# Altium project SoBQ.PrjPCB
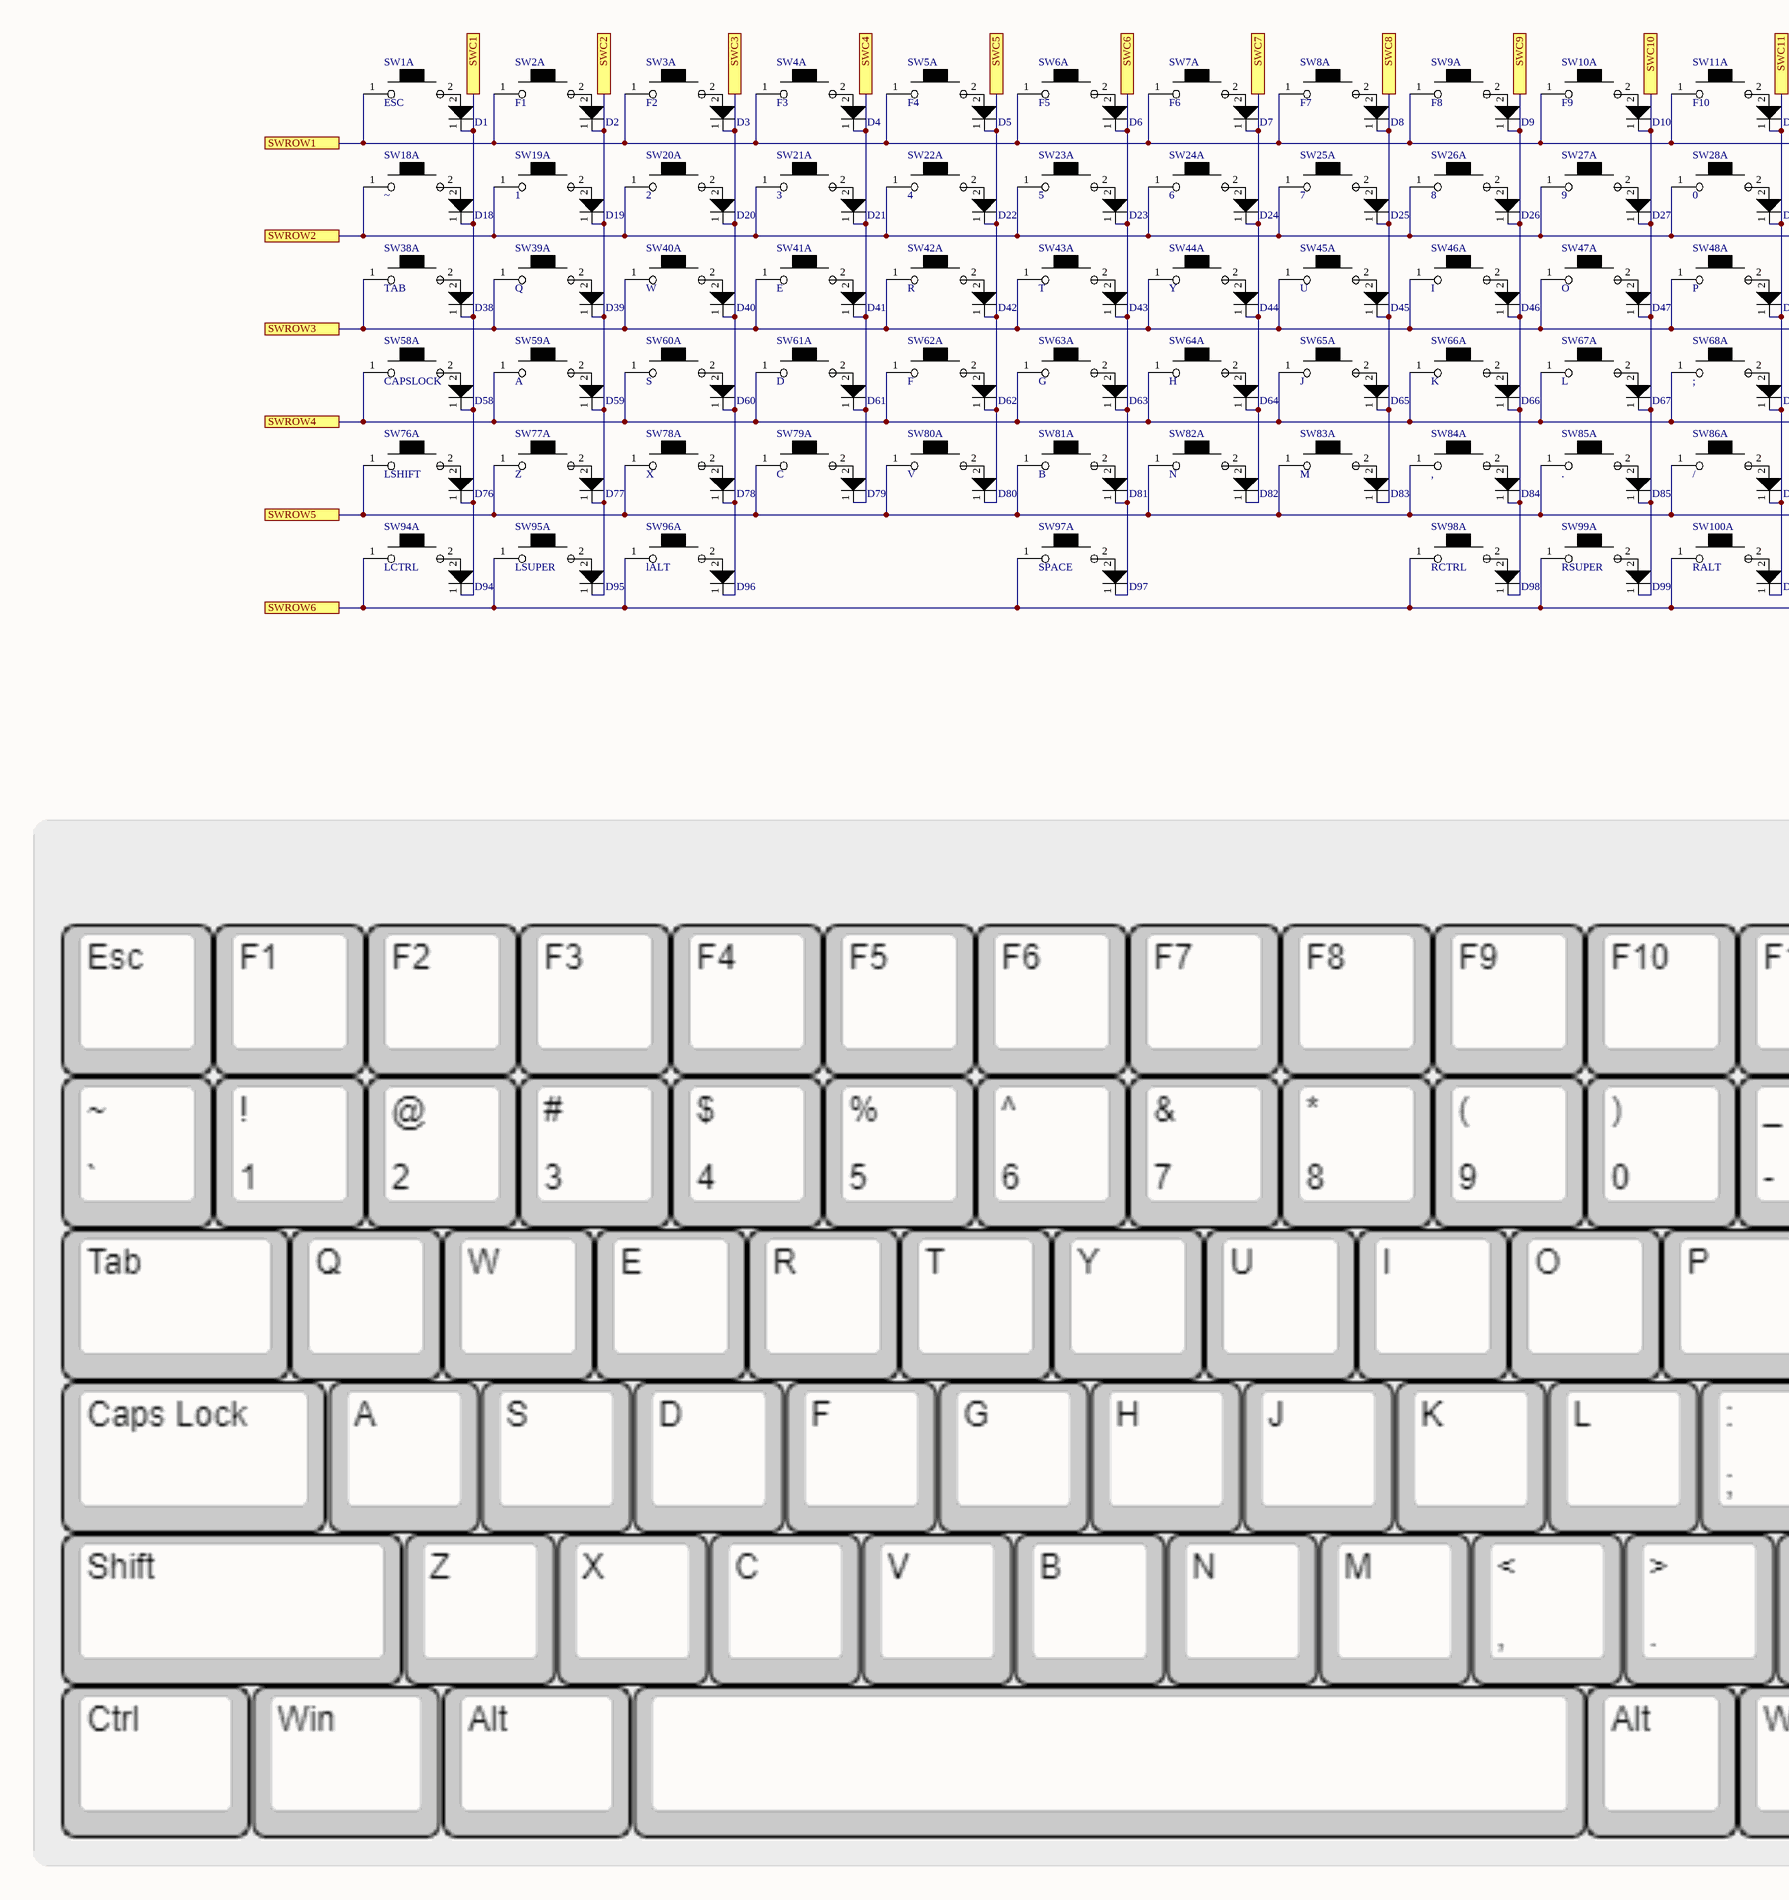
[diagram p0: switches.SchDoc, left]
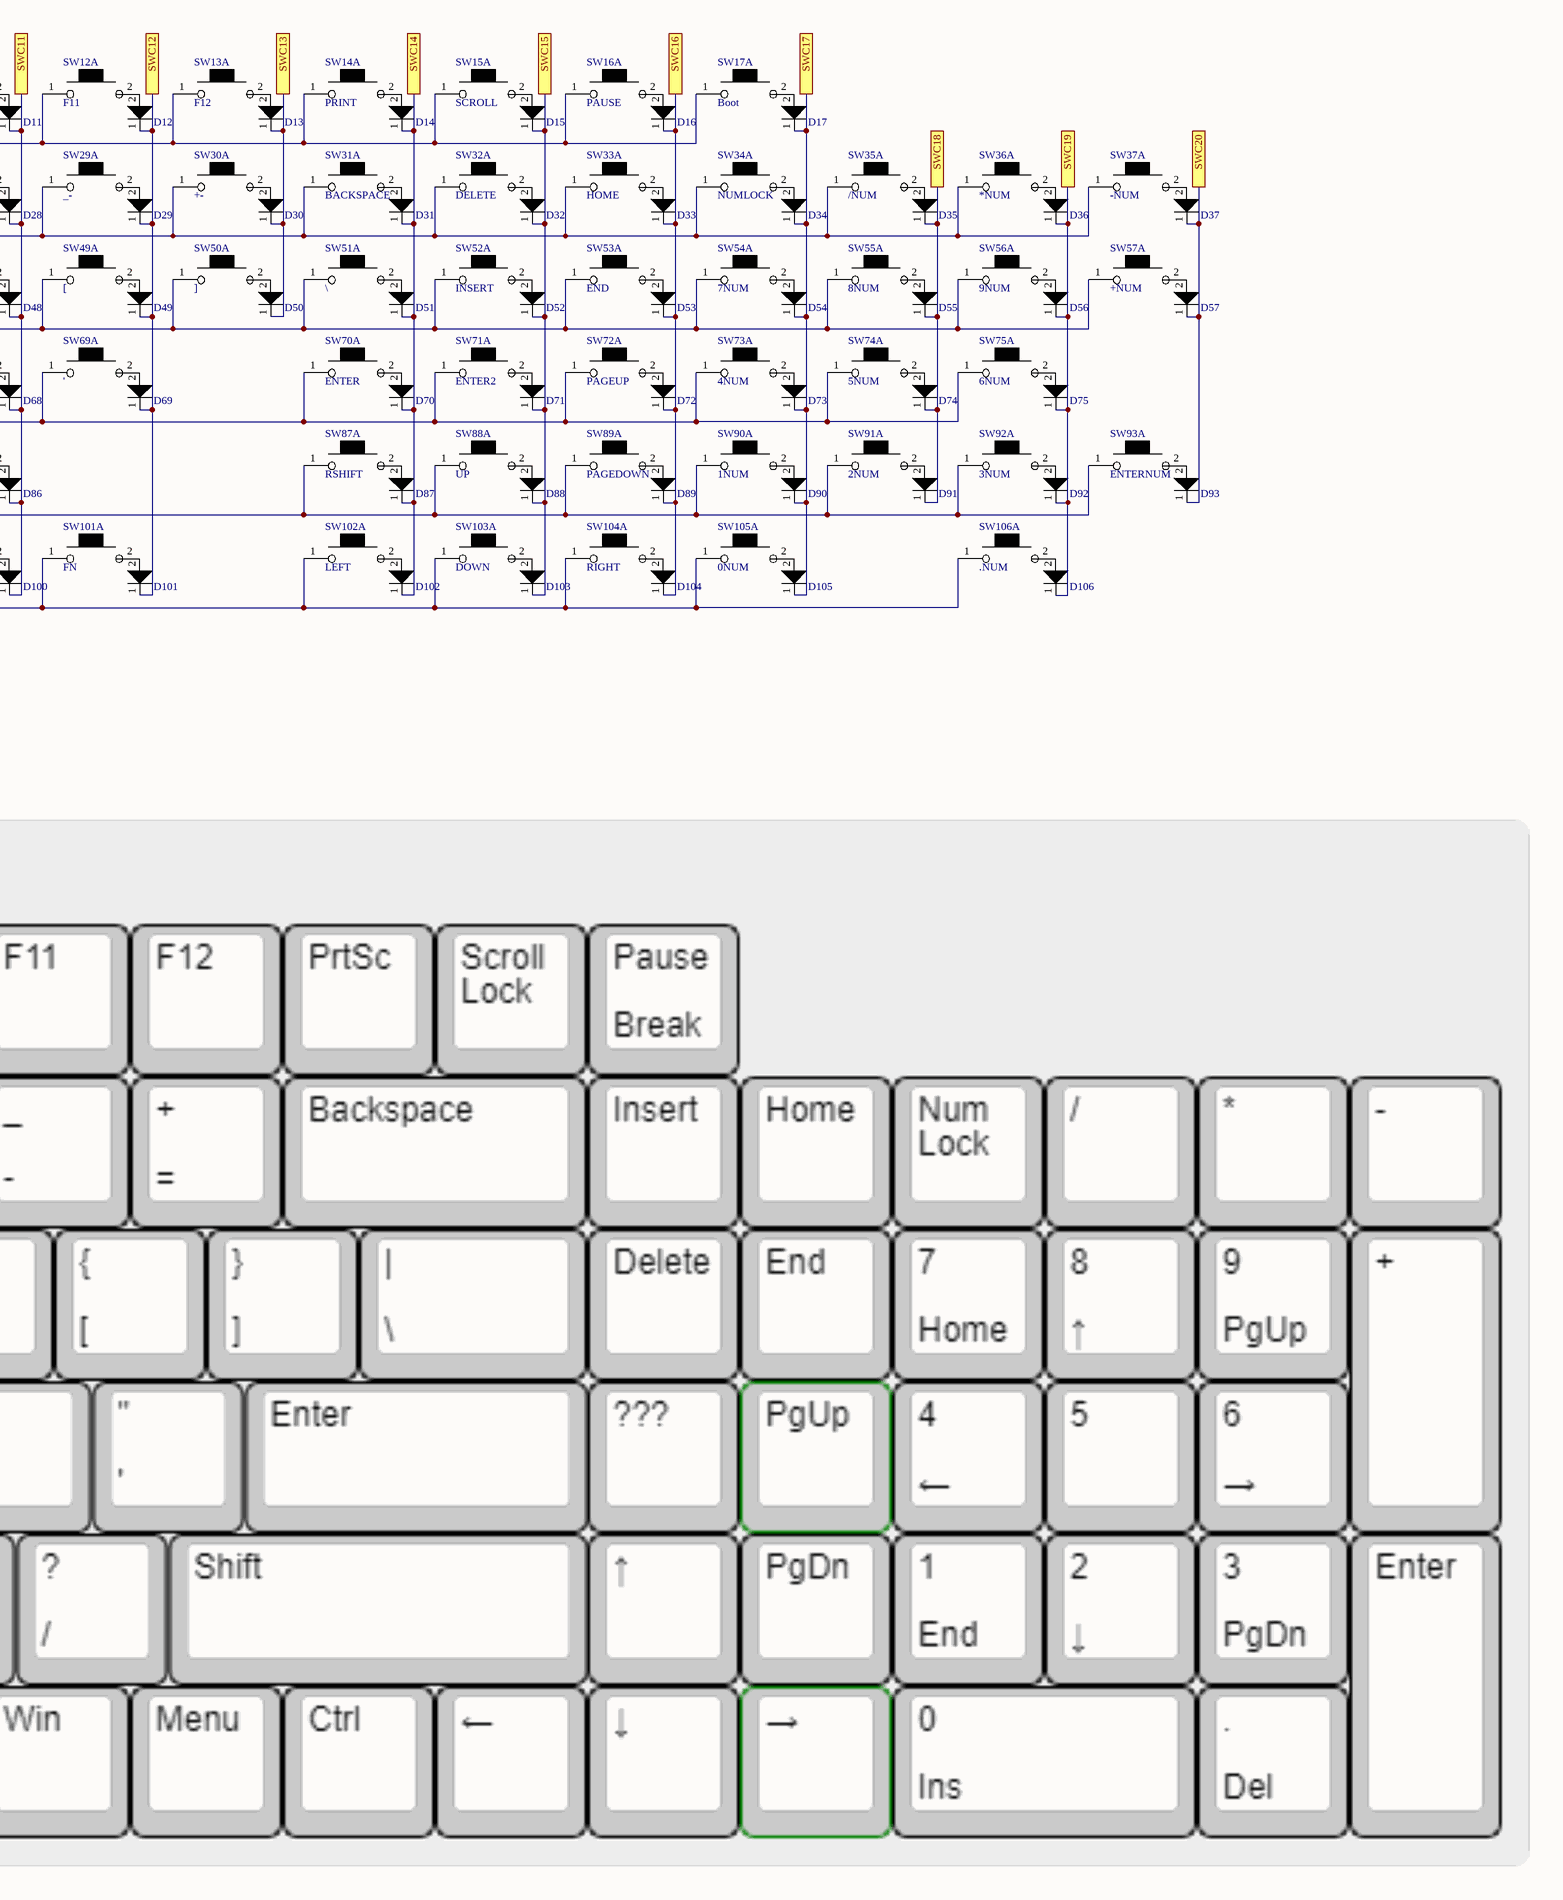
[diagram p1: switches.SchDoc, right]
3 sheets, 315 parts. Net scope: flat (ports and power ports of the same name join across sheets).
Board file: SoBQ.PcbDoc
Sheets:
  switches.SchDoc
  LED.SchDoc
  MCU.SchDoc

## Sheet switches.SchDoc
size D

### Parts
D1  1N4148WTR  [SOD-123]  (value not drawn)
D2  1N4148WTR  [SOD-123]  (value not drawn)
D3  1N4148WTR  [SOD-123]  (value not drawn)
D4  1N4148WTR  [SOD-123]  (value not drawn)
D5  1N4148WTR  [SOD-123]  (value not drawn)
D6  1N4148WTR  [SOD-123]  (value not drawn)
D7  1N4148WTR  [SOD-123]  (value not drawn)
D8  1N4148WTR  [SOD-123]  (value not drawn)
D9  1N4148WTR  [SOD-123]  (value not drawn)
D10  1N4148WTR  [SOD-123]  (value not drawn)
D11  1N4148WTR  [SOD-123]  (value not drawn)
D12  1N4148WTR  [SOD-123]  (value not drawn)
D13  1N4148WTR  [SOD-123]  (value not drawn)
D14  1N4148WTR  [SOD-123]  (value not drawn)
D15  1N4148WTR  [SOD-123]  (value not drawn)
D16  1N4148WTR  [SOD-123]  (value not drawn)
D17  1N4148WTR  [SOD-123]  (value not drawn)
D18  1N4148WTR  [SOD-123]  (value not drawn)
D19  1N4148WTR  [SOD-123]  (value not drawn)
D20  1N4148WTR  [SOD-123]  (value not drawn)
D21  1N4148WTR  [SOD-123]  (value not drawn)
D22  1N4148WTR  [SOD-123]  (value not drawn)
D23  1N4148WTR  [SOD-123]  (value not drawn)
D24  1N4148WTR  [SOD-123]  (value not drawn)
D25  1N4148WTR  [SOD-123]  (value not drawn)
D26  1N4148WTR  [SOD-123]  (value not drawn)
D27  1N4148WTR  [SOD-123]  (value not drawn)
D28  1N4148WTR  [SOD-123]  (value not drawn)
D29  1N4148WTR  [SOD-123]  (value not drawn)
D30  1N4148WTR  [SOD-123]  (value not drawn)
D31  1N4148WTR  [SOD-123]  (value not drawn)
D32  1N4148WTR  [SOD-123]  (value not drawn)
D33  1N4148WTR  [SOD-123]  (value not drawn)
D34  1N4148WTR  [SOD-123]  (value not drawn)
D35  1N4148WTR  [SOD-123]  (value not drawn)
D36  1N4148WTR  [SOD-123]  (value not drawn)
D37  1N4148WTR  [SOD-123]  (value not drawn)
D38  1N4148WTR  [SOD-123]  (value not drawn)
D39  1N4148WTR  [SOD-123]  (value not drawn)
D40  1N4148WTR  [SOD-123]  (value not drawn)
D41  1N4148WTR  [SOD-123]  (value not drawn)
D42  1N4148WTR  [SOD-123]  (value not drawn)
D43  1N4148WTR  [SOD-123]  (value not drawn)
D44  1N4148WTR  [SOD-123]  (value not drawn)
D45  1N4148WTR  [SOD-123]  (value not drawn)
D46  1N4148WTR  [SOD-123]  (value not drawn)
D47  1N4148WTR  [SOD-123]  (value not drawn)
D48  1N4148WTR  [SOD-123]  (value not drawn)
D49  1N4148WTR  [SOD-123]  (value not drawn)
D50  1N4148WTR  [SOD-123]  (value not drawn)
D51  1N4148WTR  [SOD-123]  (value not drawn)
D52  1N4148WTR  [SOD-123]  (value not drawn)
D53  1N4148WTR  [SOD-123]  (value not drawn)
D54  1N4148WTR  [SOD-123]  (value not drawn)
D55  1N4148WTR  [SOD-123]  (value not drawn)
D56  1N4148WTR  [SOD-123]  (value not drawn)
D57  1N4148WTR  [SOD-123]  (value not drawn)
D58  1N4148WTR  [SOD-123]  (value not drawn)
D59  1N4148WTR  [SOD-123]  (value not drawn)
D60  1N4148WTR  [SOD-123]  (value not drawn)
D61  1N4148WTR  [SOD-123]  (value not drawn)
D62  1N4148WTR  [SOD-123]  (value not drawn)
D63  1N4148WTR  [SOD-123]  (value not drawn)
D64  1N4148WTR  [SOD-123]  (value not drawn)
D65  1N4148WTR  [SOD-123]  (value not drawn)
D66  1N4148WTR  [SOD-123]  (value not drawn)
D67  1N4148WTR  [SOD-123]  (value not drawn)
D68  1N4148WTR  [SOD-123]  (value not drawn)
D69  1N4148WTR  [SOD-123]  (value not drawn)
D70  1N4148WTR  [SOD-123]  (value not drawn)
D71  1N4148WTR  [SOD-123]  (value not drawn)
D72  1N4148WTR  [SOD-123]  (value not drawn)
D73  1N4148WTR  [SOD-123]  (value not drawn)
D74  1N4148WTR  [SOD-123]  (value not drawn)
D75  1N4148WTR  [SOD-123]  (value not drawn)
D76  1N4148WTR  [SOD-123]  (value not drawn)
D77  1N4148WTR  [SOD-123]  (value not drawn)
D78  1N4148WTR  [SOD-123]  (value not drawn)
D79  1N4148WTR  [SOD-123]  (value not drawn)
D80  1N4148WTR  [SOD-123]  (value not drawn)
D81  1N4148WTR  [SOD-123]  (value not drawn)
D82  1N4148WTR  [SOD-123]  (value not drawn)
D83  1N4148WTR  [SOD-123]  (value not drawn)
D84  1N4148WTR  [SOD-123]  (value not drawn)
D85  1N4148WTR  [SOD-123]  (value not drawn)
D86  1N4148WTR  [SOD-123]  (value not drawn)
D87  1N4148WTR  [SOD-123]  (value not drawn)
D88  1N4148WTR  [SOD-123]  (value not drawn)
D89  1N4148WTR  [SOD-123]  (value not drawn)
D90  1N4148WTR  [SOD-123]  (value not drawn)
D91  1N4148WTR  [SOD-123]  (value not drawn)
D92  1N4148WTR  [SOD-123]  (value not drawn)
D93  1N4148WTR  [SOD-123]  (value not drawn)
D94  1N4148WTR  [SOD-123]  (value not drawn)
D95  1N4148WTR  [SOD-123]  (value not drawn)
D96  1N4148WTR  [SOD-123]  (value not drawn)
D97  1N4148WTR  [SOD-123]  (value not drawn)
D98  1N4148WTR  [SOD-123]  (value not drawn)
D99  1N4148WTR  [SOD-123]  (value not drawn)
D100  1N4148WTR  [SOD-123]  (value not drawn)
D101  1N4148WTR  [SOD-123]  (value not drawn)
D102  1N4148WTR  [SOD-123]  (value not drawn)
D103  1N4148WTR  [SOD-123]  (value not drawn)
D104  1N4148WTR  [SOD-123]  (value not drawn)
D105  1N4148WTR  [SOD-123]  (value not drawn)
D106  1N4148WTR  [SOD-123]  (value not drawn)
SW1  ESC  [SWITCH_U1_W_LED]  (part A of 2)
SW2  F1  [SWITCH_U1_W_LED]  (part A of 2)
SW3  F2  [SWITCH_U1_W_LED]  (part A of 2)
SW4  F3  [SWITCH_U1_W_LED]  (part A of 2)
SW5  F4  [SWITCH_U1_W_LED]  (part A of 2)
SW6  F5  [SWITCH_U1_W_LED]  (part A of 2)
SW7  F6  [SWITCH_U1_W_LED]  (part A of 2)
SW8  F7  [SWITCH_U1_W_LED]  (part A of 2)
SW9  F8  [SWITCH_U1_W_LED]  (part A of 2)
SW10  F9  [SWITCH_U1_W_LED]  (part A of 2)
SW11  F10  [SWITCH_U1_W_LED]  (part A of 2)
SW12  F11  [SWITCH_U1_W_LED]  (part A of 2)
SW13  F12  [SWITCH_U1_W_LED]  (part A of 2)
SW14  PRINT  [SWITCH_U1_W_LED]  (part A of 2)
SW15  SCROLL  [SWITCH_U1_W_LED]  (part A of 2)
SW16  PAUSE  [SWITCH_U1_W_LED]  (part A of 2)
SW17  Boot  [SWITCH_U1_W_LED]  (part A of 2)
SW18  ~  [SWITCH_U1_W_LED]  (part A of 2)
SW19  1  [SWITCH_U1_W_LED]  (part A of 2)
SW20  2  [SWITCH_U1_W_LED]  (part A of 2)
SW21  3  [SWITCH_U1_W_LED]  (part A of 2)
SW22  4  [SWITCH_U1_W_LED]  (part A of 2)
SW23  5  [SWITCH_U1_W_LED]  (part A of 2)
SW24  6  [SWITCH_U1_W_LED]  (part A of 2)
SW25  7  [SWITCH_U1_W_LED]  (part A of 2)
SW26  8  [SWITCH_U1_W_LED]  (part A of 2)
SW27  9  [SWITCH_U1_W_LED]  (part A of 2)
SW28  0  [SWITCH_U1_W_LED]  (part A of 2)
SW29  _-  [SWITCH_U1_W_LED]  (part A of 2)
SW30  +-  [SWITCH_U1_W_LED]  (part A of 2)
SW31  BACKSPACE  [SWITCH_U2_W_LED]  (part A of 2)
SW32  DELETE  [SWITCH_U1_W_LED]  (part A of 2)
SW33  HOME  [SWITCH_U1_W_LED]  (part A of 2)
SW34  NUMLOCK  [SWITCH_U1_W_LED]  (part A of 2)
SW35  /NUM  [SWITCH_U1_W_LED]  (part A of 2)
SW36  *NUM  [SWITCH_U1_W_LED]  (part A of 2)
SW37  -NUM  [SWITCH_U1_W_LED]  (part A of 2)
SW38  TAB  [SWITCH_U1.50_W_LED]  (part A of 2)
SW39  Q  [SWITCH_U1_W_LED]  (part A of 2)
SW40  W  [SWITCH_U1_W_LED]  (part A of 2)
SW41  E  [SWITCH_U1_W_LED]  (part A of 2)
SW42  R  [SWITCH_U1_W_LED]  (part A of 2)
SW43  T  [SWITCH_U1_W_LED]  (part A of 2)
SW44  Y  [SWITCH_U1_W_LED]  (part A of 2)
SW45  U  [SWITCH_U1_W_LED]  (part A of 2)
SW46  I  [SWITCH_U1_W_LED]  (part A of 2)
SW47  O  [SWITCH_U1_W_LED]  (part A of 2)
SW48  P  [SWITCH_U1_W_LED]  (part A of 2)
SW49  [  [SWITCH_U1_W_LED]  (part A of 2)
SW50  ]  [SWITCH_U1_W_LED]  (part A of 2)
SW51  \  [SWITCH_U1.50_W_LED]  (part A of 2)
SW52  INSERT  [SWITCH_U1_W_LED]  (part A of 2)
SW53  END  [SWITCH_U1_W_LED]  (part A of 2)
SW54  7NUM  [SWITCH_U1_W_LED]  (part A of 2)
SW55  8NUM  [SWITCH_U1_W_LED]  (part A of 2)
SW56  9NUM  [SWITCH_U1_W_LED]  (part A of 2)
SW57  +NUM  [SWITCH_U2_W_LED - vert]  (part A of 2)
SW58  CAPSLOCK  [SWITCH_U1.75_W_LED]  (part A of 2)
SW59  A  [SWITCH_U1_W_LED]  (part A of 2)
SW60  S  [SWITCH_U1_W_LED]  (part A of 2)
SW61  D  [SWITCH_U1_W_LED]  (part A of 2)
SW62  F  [SWITCH_U1_W_LED]  (part A of 2)
SW63  G  [SWITCH_U1_W_LED]  (part A of 2)
SW64  H  [SWITCH_U1_W_LED]  (part A of 2)
SW65  J  [SWITCH_U1_W_LED]  (part A of 2)
SW66  K  [SWITCH_U1_W_LED]  (part A of 2)
SW67  L  [SWITCH_U1_W_LED]  (part A of 2)
SW68  ;  [SWITCH_U1_W_LED]  (part A of 2)
SW69  '  [SWITCH_U1_W_LED]  (part A of 2)
SW70  ENTER  [SWITCH_U2.25_W_LED]  (part A of 2)
SW71  ENTER2  [SWITCH_U1_W_LED]  (part A of 2)
SW72  PAGEUP  [SWITCH_U1_W_LED]  (part A of 2)
SW73  4NUM  [SWITCH_U1_W_LED]  (part A of 2)
SW74  5NUM  [SWITCH_U1_W_LED]  (part A of 2)
SW75  6NUM  [SWITCH_U1_W_LED]  (part A of 2)
SW76  LSHIFT  [SWITCH_U2.25_W_LED]  (part A of 2)
SW77  Z  [SWITCH_U1_W_LED]  (part A of 2)
SW78  X  [SWITCH_U1_W_LED]  (part A of 2)
SW79  C  [SWITCH_U1_W_LED]  (part A of 2)
SW80  V  [SWITCH_U1_W_LED]  (part A of 2)
SW81  B  [SWITCH_U1_W_LED]  (part A of 2)
SW82  N  [SWITCH_U1_W_LED]  (part A of 2)
SW83  M  [SWITCH_U1_W_LED]  (part A of 2)
SW84  ,  [SWITCH_U1_W_LED]  (part A of 2)
SW85  .  [SWITCH_U1_W_LED]  (part A of 2)
SW86  /  [SWITCH_U1_W_LED]  (part A of 2)
SW87  RSHIFT  [SWITCH_U2.75_W_LED]  (part A of 2)
SW88  UP  [SWITCH_U1_W_LED]  (part A of 2)
SW89  PAGEDOWN  [SWITCH_U1_W_LED]  (part A of 2)
SW90  1NUM  [SWITCH_U1_W_LED]  (part A of 2)
SW91  2NUM  [SWITCH_U1_W_LED]  (part A of 2)
SW92  3NUM  [SWITCH_U1_W_LED]  (part A of 2)
SW93  ENTERNUM  [SWITCH_U2_W_LED - vert]  (part A of 2)
SW94  LCTRL  [SWITCH_U1.25_W_LED]  (part A of 2)
SW95  LSUPER  [SWITCH_U1.25_W_LED]  (part A of 2)
SW96  lALT  [SWITCH_U1.25_W_LED]  (part A of 2)
SW97  SPACE  [SWITCH_U6.25_W_LED - duplicate]  (part A of 2)
SW98  RCTRL  [SWITCH_U1_W_LED]  (part A of 2)
SW99  RSUPER  [SWITCH_U1_W_LED]  (part A of 2)
SW100  RALT  [SWITCH_U1_W_LED]  (part A of 2)
SW101  FN  [SWITCH_U1_W_LED]  (part A of 2)
SW102  LEFT  [SWITCH_U1_W_LED]  (part A of 2)
SW103  DOWN  [SWITCH_U1_W_LED]  (part A of 2)
SW104  RIGHT  [SWITCH_U1_W_LED]  (part A of 2)
SW105  0NUM  [SWITCH_U2_W_LED]  (part A of 2)
SW106  .NUM  [SWITCH_U1_W_LED]  (part A of 2)

### Ports
SWC1, SWC2, SWC3, SWC4, SWC5, SWC6, SWC7, SWC8, SWC9, SWC10, SWC11, SWC12, SWC13, SWC14, SWC15, SWC16, SWC17, SWC18, SWC19, SWC20, SWROW1, SWROW2, SWROW3, SWROW4, SWROW5, SWROW6

### Nets
NetD1_1: D1.1 D18.1 D38.1 D58.1 D76.1 D94.1 ; port SWC1
NetD1_2: D1.2 SW1.2
NetD2_1: D2.1 D19.1 D39.1 D59.1 D77.1 D95.1 ; port SWC2
NetD2_2: D2.2 SW2.2
NetD3_1: D3.1 D20.1 D40.1 D60.1 D78.1 D96.1 ; port SWC3
NetD3_2: D3.2 SW3.2
NetD4_1: D4.1 D21.1 D41.1 D61.1 D79.1 ; port SWC4
NetD4_2: D4.2 SW4.2
NetD5_1: D5.1 D22.1 D42.1 D62.1 D80.1 ; port SWC5
NetD5_2: D5.2 SW5.2
NetD6_1: D6.1 D23.1 D43.1 D63.1 D81.1 D97.1 ; port SWC6
NetD6_2: D6.2 SW6.2
NetD7_1: D7.1 D24.1 D44.1 D64.1 D82.1 ; port SWC7
NetD7_2: D7.2 SW7.2
NetD8_1: D8.1 D25.1 D45.1 D65.1 D83.1 ; port SWC8
NetD8_2: D8.2 SW8.2
NetD9_1: D9.1 D26.1 D46.1 D66.1 D84.1 D98.1 ; port SWC9
NetD9_2: D9.2 SW9.2
NetD10_1: D10.1 D27.1 D47.1 D67.1 D85.1 D99.1 ; port SWC10
NetD10_2: D10.2 SW10.2
NetD11_1: D11.1 D28.1 D48.1 D68.1 D86.1 D100.1 ; port SWC11
NetD11_2: D11.2 SW11.2
NetD12_1: D12.1 D29.1 D49.1 D69.1 D101.1 ; port SWC12
NetD12_2: D12.2 SW12.2
NetD13_1: D13.1 D30.1 D50.1 ; port SWC13
NetD13_2: D13.2 SW13.2
NetD14_1: D14.1 D31.1 D51.1 D70.1 D87.1 D102.1 ; port SWC14
NetD14_2: D14.2 SW14.2
NetD15_1: D15.1 D32.1 D52.1 D71.1 D88.1 D103.1 ; port SWC15
NetD15_2: D15.2 SW15.2
NetD16_1: D16.1 D33.1 D53.1 D72.1 D89.1 D104.1 ; port SWC16
NetD16_2: D16.2 SW16.2
NetD17_1: D17.1 D34.1 D54.1 D73.1 D90.1 D105.1 ; port SWC17
NetD17_2: D17.2 SW17.2
NetD18_2: D18.2 SW18.2
NetD19_2: D19.2 SW19.2
NetD20_2: D20.2 SW20.2
NetD21_2: D21.2 SW21.2
NetD22_2: D22.2 SW22.2
NetD23_2: D23.2 SW23.2
NetD24_2: D24.2 SW24.2
NetD25_2: D25.2 SW25.2
NetD26_2: D26.2 SW26.2
NetD27_2: D27.2 SW27.2
NetD28_2: D28.2 SW28.2
NetD29_2: D29.2 SW29.2
NetD30_2: D30.2 SW30.2
NetD31_2: D31.2 SW31.2
NetD32_2: D32.2 SW32.2
NetD33_2: D33.2 SW33.2
NetD34_2: D34.2 SW34.2
NetD35_1: D35.1 D55.1 D74.1 D91.1 ; port SWC18
NetD35_2: D35.2 SW35.2
NetD36_1: D36.1 D56.1 D75.1 D92.1 D106.1 ; port SWC19
NetD36_2: D36.2 SW36.2
NetD37_1: D37.1 D57.1 D93.1 ; port SWC20
NetD37_2: D37.2 SW37.2
NetD38_2: D38.2 SW38.2
NetD39_2: D39.2 SW39.2
NetD40_2: D40.2 SW40.2
NetD41_2: D41.2 SW41.2
NetD42_2: D42.2 SW42.2
NetD43_2: D43.2 SW43.2
NetD44_2: D44.2 SW44.2
NetD45_2: D45.2 SW45.2
NetD46_2: D46.2 SW46.2
NetD47_2: D47.2 SW47.2
NetD48_2: D48.2 SW48.2
NetD49_2: D49.2 SW49.2
NetD50_2: D50.2 SW50.2
NetD51_2: D51.2 SW51.2
NetD52_2: D52.2 SW52.2
NetD53_2: D53.2 SW53.2
NetD54_2: D54.2 SW54.2
NetD55_2: D55.2 SW55.2
NetD56_2: D56.2 SW56.2
NetD57_2: D57.2 SW57.2
NetD58_2: D58.2 SW58.2
NetD59_2: D59.2 SW59.2
NetD60_2: D60.2 SW60.2
NetD61_2: D61.2 SW61.2
NetD62_2: D62.2 SW62.2
NetD63_2: D63.2 SW63.2
NetD64_2: D64.2 SW64.2
NetD65_2: D65.2 SW65.2
NetD66_2: D66.2 SW66.2
NetD67_2: D67.2 SW67.2
NetD68_2: D68.2 SW68.2
NetD69_2: D69.2 SW69.2
NetD70_2: D70.2 SW70.2
NetD71_2: D71.2 SW71.2
NetD72_2: D72.2 SW72.2
NetD73_2: D73.2 SW73.2
NetD74_2: D74.2 SW74.2
NetD75_2: D75.2 SW75.2
NetD76_2: D76.2 SW76.2
NetD77_2: D77.2 SW77.2
NetD78_2: D78.2 SW78.2
NetD79_2: D79.2 SW79.2
NetD80_2: D80.2 SW80.2
NetD81_2: D81.2 SW81.2
NetD82_2: D82.2 SW82.2
NetD83_2: D83.2 SW83.2
NetD84_2: D84.2 SW84.2
NetD85_2: D85.2 SW85.2
NetD86_2: D86.2 SW86.2
NetD87_2: D87.2 SW87.2
NetD88_2: D88.2 SW88.2
NetD89_2: D89.2 SW89.2
NetD90_2: D90.2 SW90.2
NetD91_2: D91.2 SW91.2
NetD92_2: D92.2 SW92.2
NetD93_2: D93.2 SW93.2
NetD94_2: D94.2 SW94.2
NetD95_2: D95.2 SW95.2
NetD96_2: D96.2 SW96.2
NetD97_2: D97.2 SW97.2
NetD98_2: D98.2 SW98.2
NetD99_2: D99.2 SW99.2
NetD100_2: D100.2 SW100.2
NetD101_2: D101.2 SW101.2
NetD102_2: D102.2 SW102.2
NetD103_2: D103.2 SW103.2
NetD104_2: D104.2 SW104.2
NetD105_2: D105.2 SW105.2
NetD106_2: D106.2 SW106.2
NetR39_2: SW94.1 SW95.1 SW96.1 SW97.1 SW98.1 SW99.1 SW100.1 SW101.1 SW102.1 SW103.1 SW104.1 SW105.1 SW106.1 ; port SWROW6
NetR45_2: SW76.1 SW77.1 SW78.1 SW79.1 SW80.1 SW81.1 SW82.1 SW83.1 SW84.1 SW85.1 SW86.1 SW87.1 SW88.1 SW89.1 SW90.1 SW91.1 SW92.1 SW93.1 ; port SWROW5
NetR47_2: SW58.1 SW59.1 SW60.1 SW61.1 SW62.1 SW63.1 SW64.1 SW65.1 SW66.1 SW67.1 SW68.1 SW69.1 SW70.1 SW71.1 SW72.1 SW73.1 SW74.1 SW75.1 ; port SWROW4
NetR48_2: SW38.1 SW39.1 SW40.1 SW41.1 SW42.1 SW43.1 SW44.1 SW45.1 SW46.1 SW47.1 SW48.1 SW49.1 SW50.1 SW51.1 SW52.1 SW53.1 SW54.1 SW55.1 SW56.1 SW57.1 ; port SWROW3
NetR49_2: SW18.1 SW19.1 SW20.1 SW21.1 SW22.1 SW23.1 SW24.1 SW25.1 SW26.1 SW27.1 SW28.1 SW29.1 SW30.1 SW31.1 SW32.1 SW33.1 SW34.1 SW35.1 SW36.1 SW37.1 ; port SWROW2
NetR50_2: SW1.1 SW2.1 SW3.1 SW4.1 SW5.1 SW6.1 SW7.1 SW8.1 SW9.1 SW10.1 SW11.1 SW12.1 SW13.1 SW14.1 SW15.1 SW16.1 SW17.1 ; port SWROW1

### Notes on the sheet
- Title
- Size:
- Date:
- File:
- D
- Number:
- Time:
- Revision:
- Sheet
- of

### Library data of the parts
SW1-SW106 = MX_SWITCH_SINGLE_W_SMD_LED: Supplier 1: Mouser; Supplier Part Number 1: 630-ASMB-MTB0-0A3A2
D1-D106 = 1N4148WTR: Supplier 1: Digi-Key; Supplier Part Number 1: 1655-1360-1-ND

## Sheet LED.SchDoc
size C
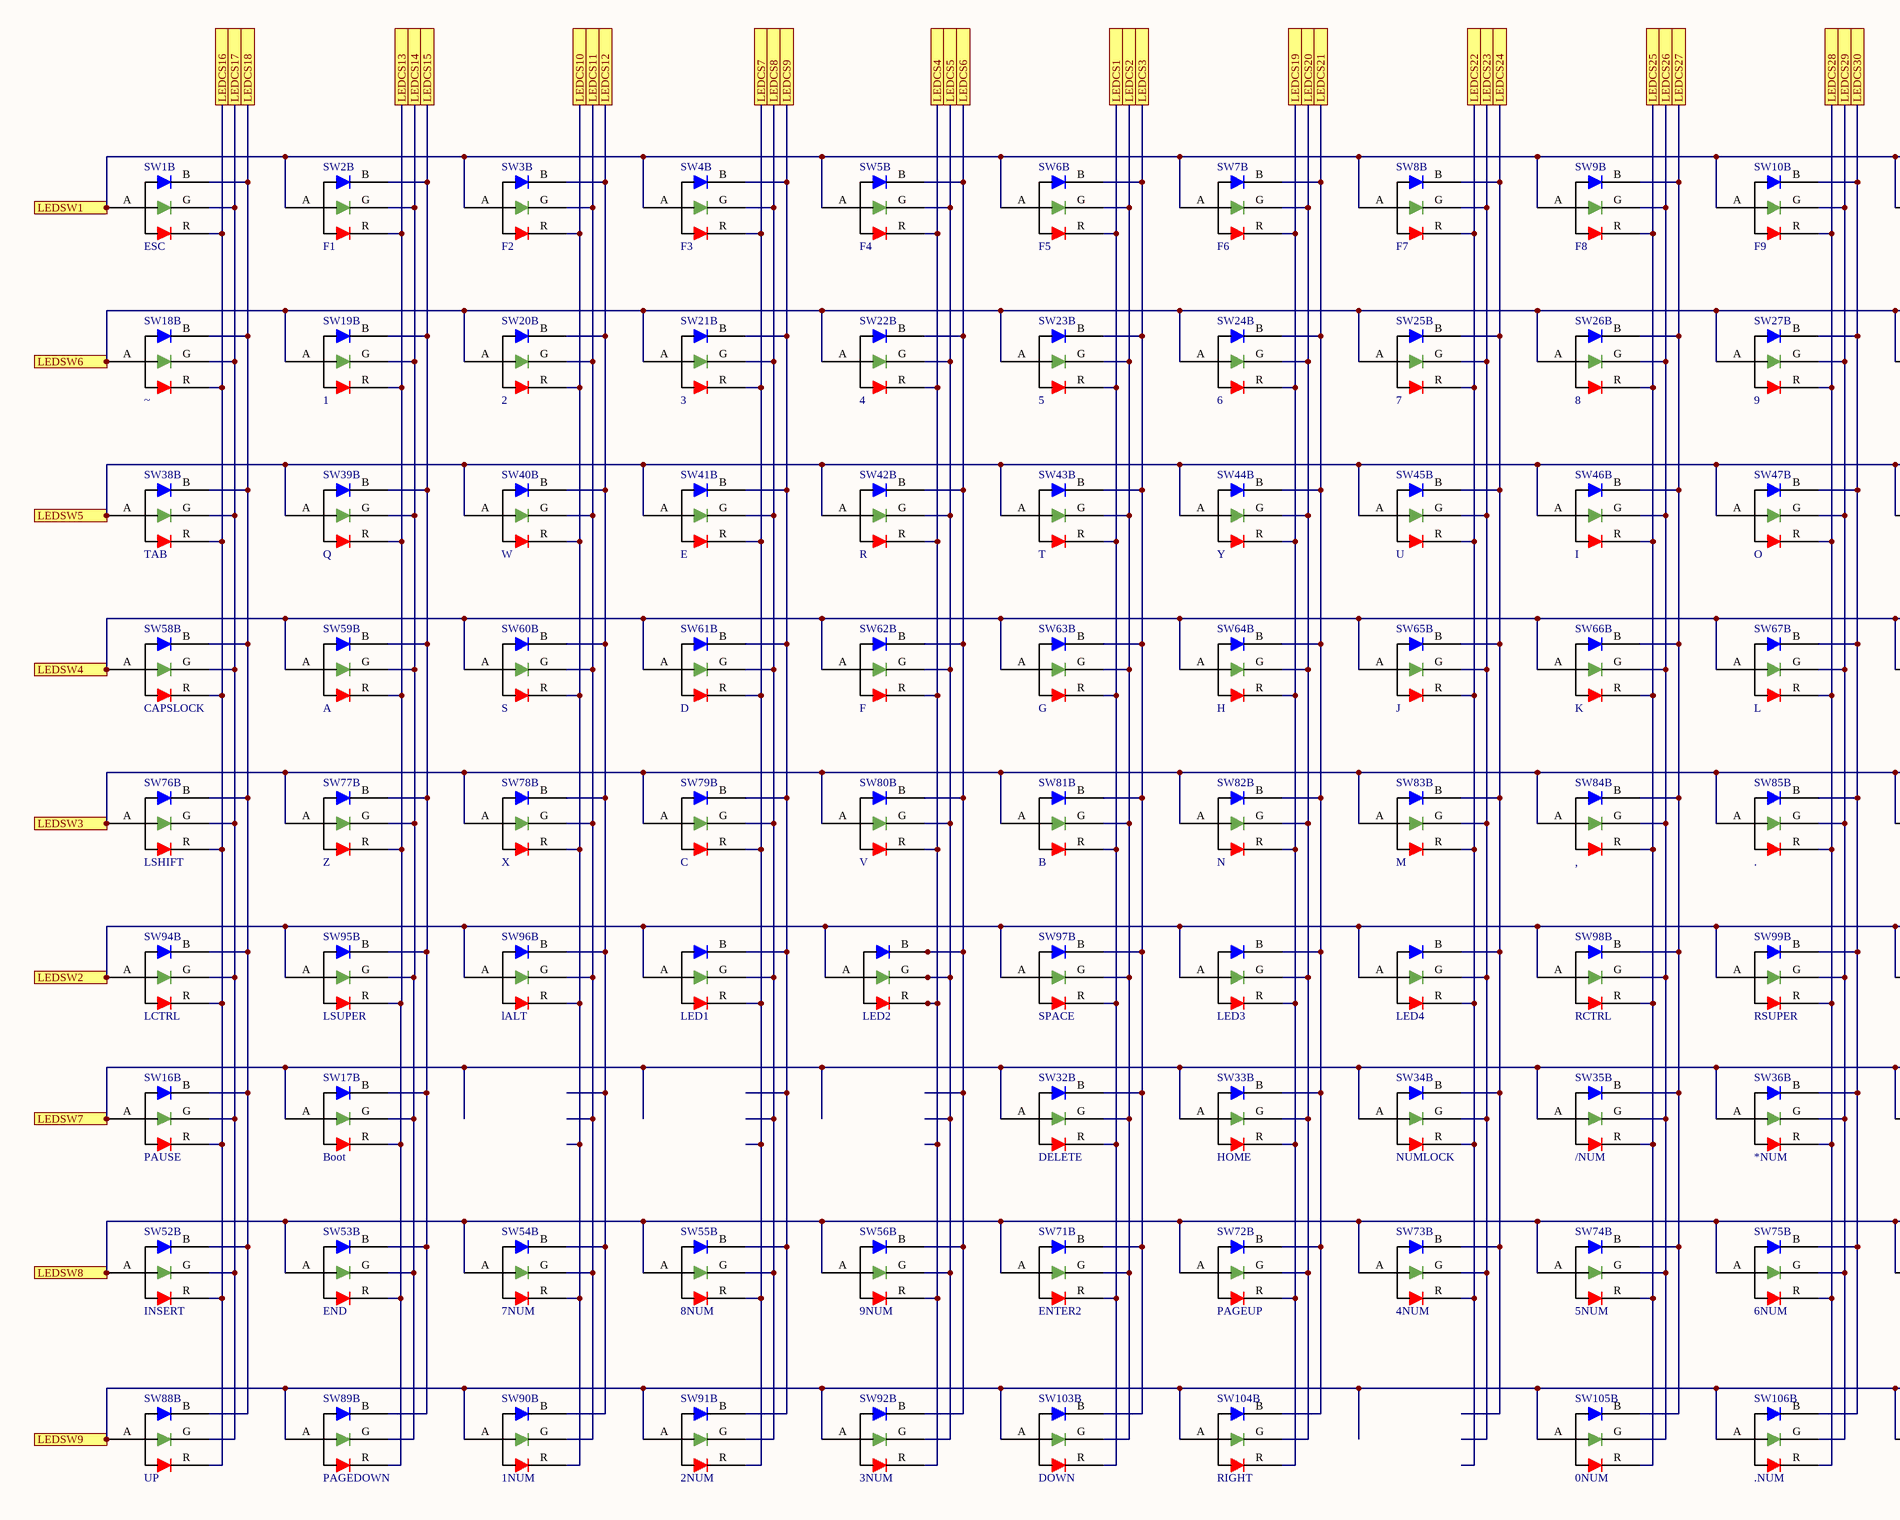
[diagram p2: LED.SchDoc, left]
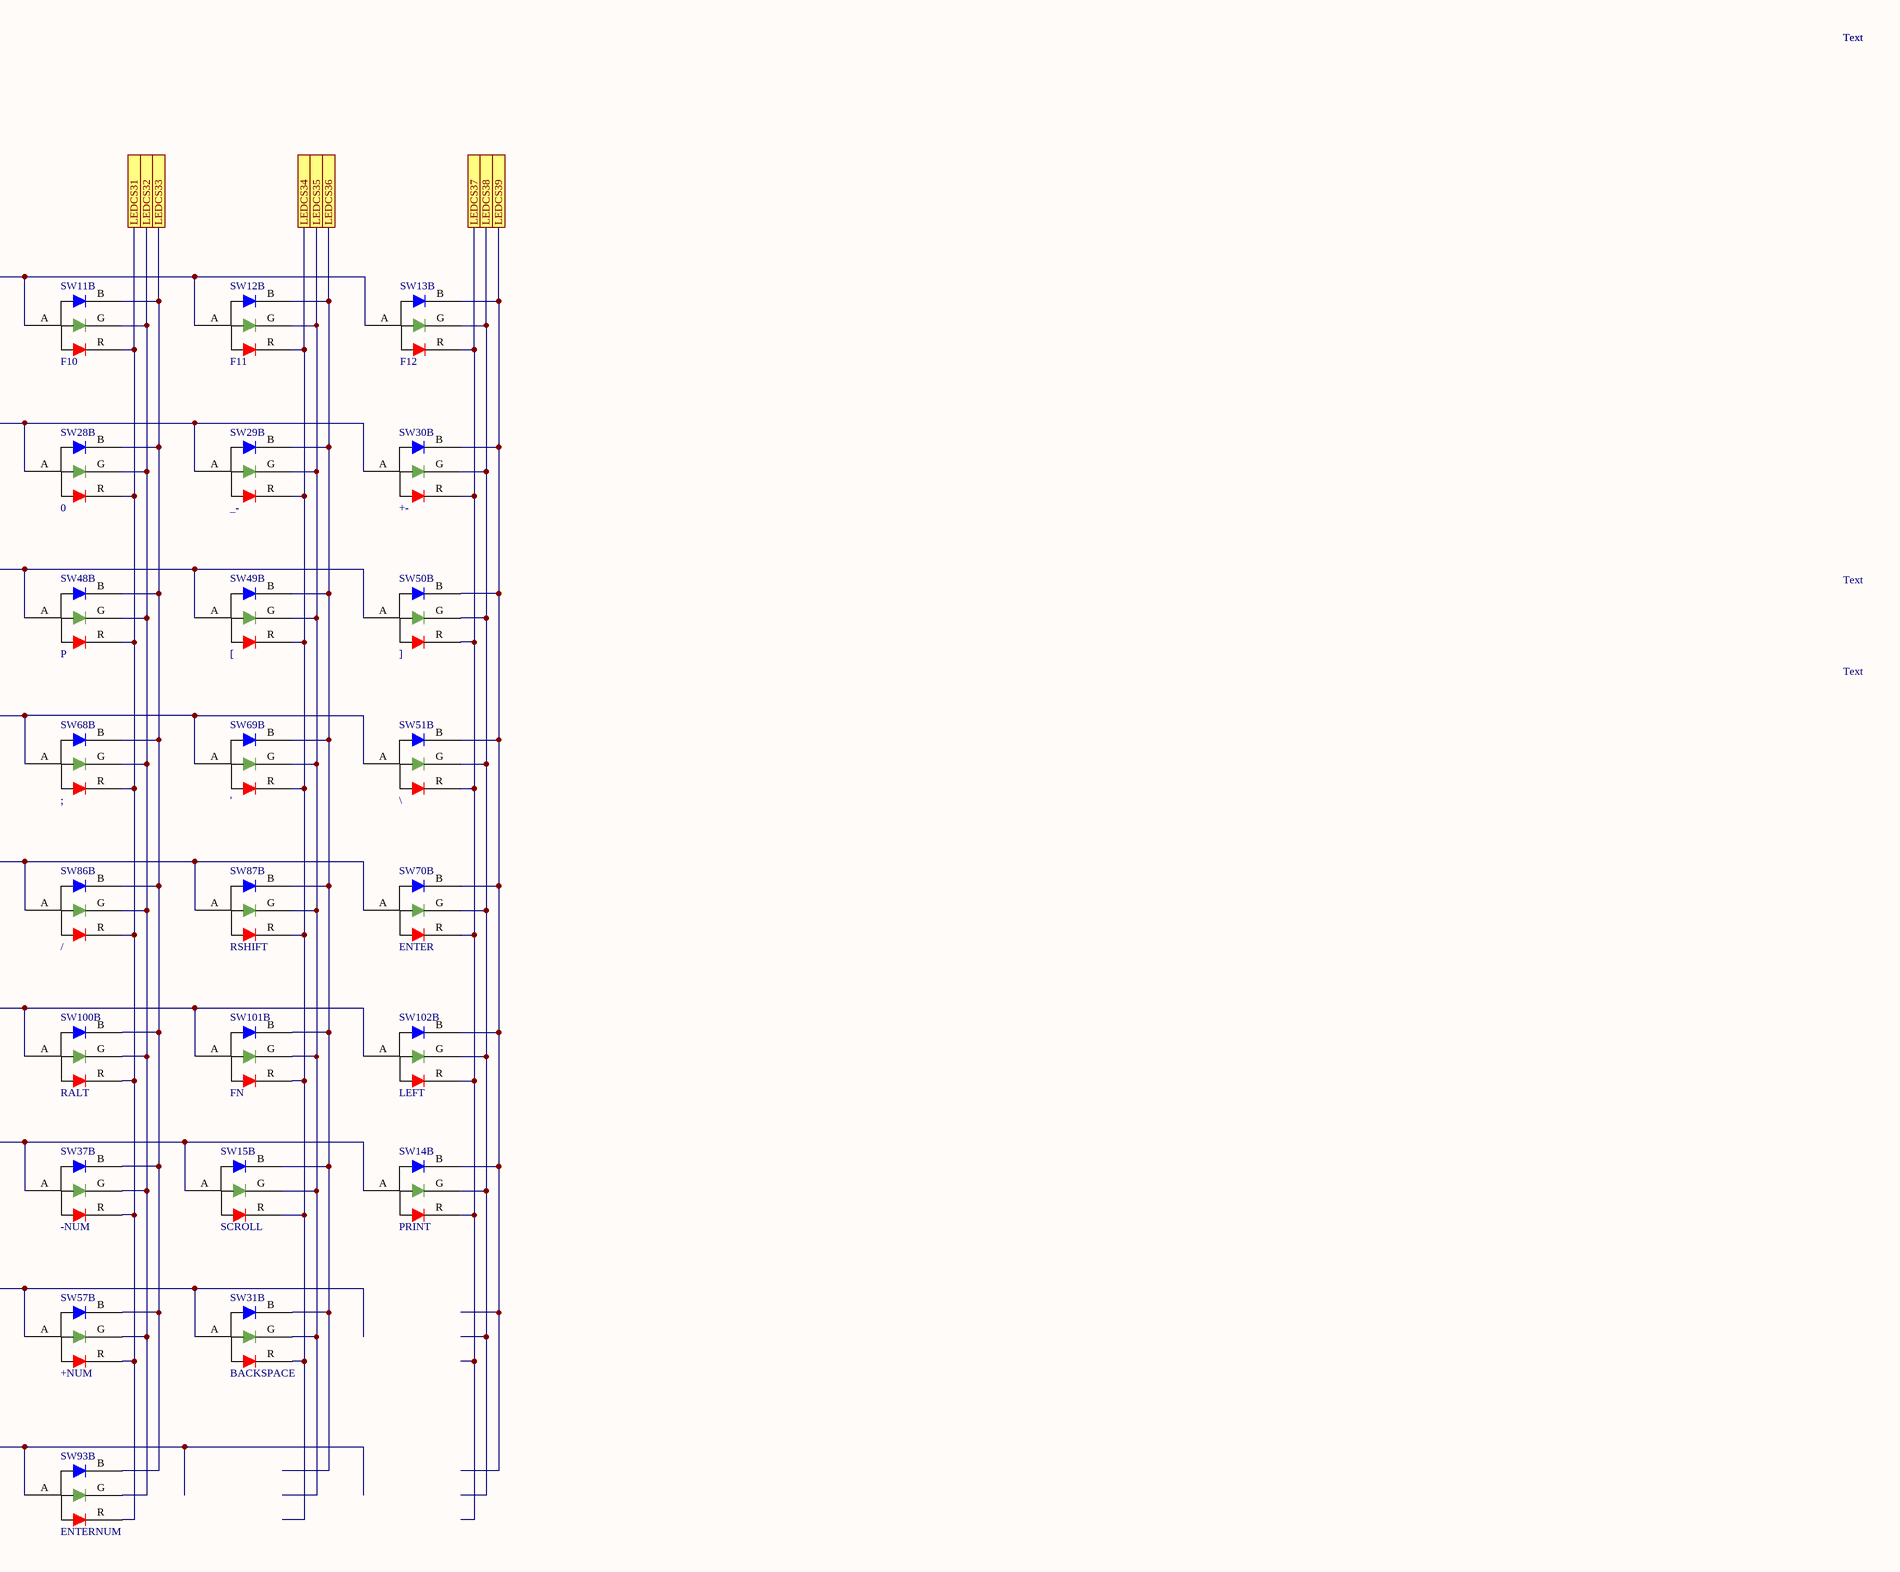
[diagram p3: LED.SchDoc, right]

### Parts
LED1  ASMB-MTB0-0A3A2  [smd led]  (value not drawn)
LED2  ASMB-MTB0-0A3A2  [smd led]  (value not drawn)
LED3  ASMB-MTB0-0A3A2  [smd led]  (value not drawn)
LED4  ASMB-MTB0-0A3A2  [smd led]  (value not drawn)
SW1  ESC  [SWITCH_U1_W_LED]  (part B of 2)
SW2  F1  [SWITCH_U1_W_LED]  (part B of 2)
SW3  F2  [SWITCH_U1_W_LED]  (part B of 2)
SW4  F3  [SWITCH_U1_W_LED]  (part B of 2)
SW5  F4  [SWITCH_U1_W_LED]  (part B of 2)
SW6  F5  [SWITCH_U1_W_LED]  (part B of 2)
SW7  F6  [SWITCH_U1_W_LED]  (part B of 2)
SW8  F7  [SWITCH_U1_W_LED]  (part B of 2)
SW9  F8  [SWITCH_U1_W_LED]  (part B of 2)
SW10  F9  [SWITCH_U1_W_LED]  (part B of 2)
SW11  F10  [SWITCH_U1_W_LED]  (part B of 2)
SW12  F11  [SWITCH_U1_W_LED]  (part B of 2)
SW13  F12  [SWITCH_U1_W_LED]  (part B of 2)
SW14  PRINT  [SWITCH_U1_W_LED]  (part B of 2)
SW15  SCROLL  [SWITCH_U1_W_LED]  (part B of 2)
SW16  PAUSE  [SWITCH_U1_W_LED]  (part B of 2)
SW17  Boot  [SWITCH_U1_W_LED]  (part B of 2)
SW18  ~  [SWITCH_U1_W_LED]  (part B of 2)
SW19  1  [SWITCH_U1_W_LED]  (part B of 2)
SW20  2  [SWITCH_U1_W_LED]  (part B of 2)
SW21  3  [SWITCH_U1_W_LED]  (part B of 2)
SW22  4  [SWITCH_U1_W_LED]  (part B of 2)
SW23  5  [SWITCH_U1_W_LED]  (part B of 2)
SW24  6  [SWITCH_U1_W_LED]  (part B of 2)
SW25  7  [SWITCH_U1_W_LED]  (part B of 2)
SW26  8  [SWITCH_U1_W_LED]  (part B of 2)
SW27  9  [SWITCH_U1_W_LED]  (part B of 2)
SW28  0  [SWITCH_U1_W_LED]  (part B of 2)
SW29  _-  [SWITCH_U1_W_LED]  (part B of 2)
SW30  +-  [SWITCH_U1_W_LED]  (part B of 2)
SW31  BACKSPACE  [SWITCH_U2_W_LED]  (part B of 2)
SW32  DELETE  [SWITCH_U1_W_LED]  (part B of 2)
SW33  HOME  [SWITCH_U1_W_LED]  (part B of 2)
SW34  NUMLOCK  [SWITCH_U1_W_LED]  (part B of 2)
SW35  /NUM  [SWITCH_U1_W_LED]  (part B of 2)
SW36  *NUM  [SWITCH_U1_W_LED]  (part B of 2)
SW37  -NUM  [SWITCH_U1_W_LED]  (part B of 2)
SW38  TAB  [SWITCH_U1.50_W_LED]  (part B of 2)
SW39  Q  [SWITCH_U1_W_LED]  (part B of 2)
SW40  W  [SWITCH_U1_W_LED]  (part B of 2)
SW41  E  [SWITCH_U1_W_LED]  (part B of 2)
SW42  R  [SWITCH_U1_W_LED]  (part B of 2)
SW43  T  [SWITCH_U1_W_LED]  (part B of 2)
SW44  Y  [SWITCH_U1_W_LED]  (part B of 2)
SW45  U  [SWITCH_U1_W_LED]  (part B of 2)
SW46  I  [SWITCH_U1_W_LED]  (part B of 2)
SW47  O  [SWITCH_U1_W_LED]  (part B of 2)
SW48  P  [SWITCH_U1_W_LED]  (part B of 2)
SW49  [  [SWITCH_U1_W_LED]  (part B of 2)
SW50  ]  [SWITCH_U1_W_LED]  (part B of 2)
SW51  \  [SWITCH_U1.50_W_LED]  (part B of 2)
SW52  INSERT  [SWITCH_U1_W_LED]  (part B of 2)
SW53  END  [SWITCH_U1_W_LED]  (part B of 2)
SW54  7NUM  [SWITCH_U1_W_LED]  (part B of 2)
SW55  8NUM  [SWITCH_U1_W_LED]  (part B of 2)
SW56  9NUM  [SWITCH_U1_W_LED]  (part B of 2)
SW57  +NUM  [SWITCH_U2_W_LED - vert]  (part B of 2)
SW58  CAPSLOCK  [SWITCH_U1.75_W_LED]  (part B of 2)
SW59  A  [SWITCH_U1_W_LED]  (part B of 2)
SW60  S  [SWITCH_U1_W_LED]  (part B of 2)
SW61  D  [SWITCH_U1_W_LED]  (part B of 2)
SW62  F  [SWITCH_U1_W_LED]  (part B of 2)
SW63  G  [SWITCH_U1_W_LED]  (part B of 2)
SW64  H  [SWITCH_U1_W_LED]  (part B of 2)
SW65  J  [SWITCH_U1_W_LED]  (part B of 2)
SW66  K  [SWITCH_U1_W_LED]  (part B of 2)
SW67  L  [SWITCH_U1_W_LED]  (part B of 2)
SW68  ;  [SWITCH_U1_W_LED]  (part B of 2)
SW69  '  [SWITCH_U1_W_LED]  (part B of 2)
SW70  ENTER  [SWITCH_U2.25_W_LED]  (part B of 2)
SW71  ENTER2  [SWITCH_U1_W_LED]  (part B of 2)
SW72  PAGEUP  [SWITCH_U1_W_LED]  (part B of 2)
SW73  4NUM  [SWITCH_U1_W_LED]  (part B of 2)
SW74  5NUM  [SWITCH_U1_W_LED]  (part B of 2)
SW75  6NUM  [SWITCH_U1_W_LED]  (part B of 2)
SW76  LSHIFT  [SWITCH_U2.25_W_LED]  (part B of 2)
SW77  Z  [SWITCH_U1_W_LED]  (part B of 2)
SW78  X  [SWITCH_U1_W_LED]  (part B of 2)
SW79  C  [SWITCH_U1_W_LED]  (part B of 2)
SW80  V  [SWITCH_U1_W_LED]  (part B of 2)
SW81  B  [SWITCH_U1_W_LED]  (part B of 2)
SW82  N  [SWITCH_U1_W_LED]  (part B of 2)
SW83  M  [SWITCH_U1_W_LED]  (part B of 2)
SW84  ,  [SWITCH_U1_W_LED]  (part B of 2)
SW85  .  [SWITCH_U1_W_LED]  (part B of 2)
SW86  /  [SWITCH_U1_W_LED]  (part B of 2)
SW87  RSHIFT  [SWITCH_U2.75_W_LED]  (part B of 2)
SW88  UP  [SWITCH_U1_W_LED]  (part B of 2)
SW89  PAGEDOWN  [SWITCH_U1_W_LED]  (part B of 2)
SW90  1NUM  [SWITCH_U1_W_LED]  (part B of 2)
SW91  2NUM  [SWITCH_U1_W_LED]  (part B of 2)
SW92  3NUM  [SWITCH_U1_W_LED]  (part B of 2)
SW93  ENTERNUM  [SWITCH_U2_W_LED - vert]  (part B of 2)
SW94  LCTRL  [SWITCH_U1.25_W_LED]  (part B of 2)
SW95  LSUPER  [SWITCH_U1.25_W_LED]  (part B of 2)
SW96  lALT  [SWITCH_U1.25_W_LED]  (part B of 2)
SW97  SPACE  [SWITCH_U6.25_W_LED - duplicate]  (part B of 2)
SW98  RCTRL  [SWITCH_U1_W_LED]  (part B of 2)
SW99  RSUPER  [SWITCH_U1_W_LED]  (part B of 2)
SW100  RALT  [SWITCH_U1_W_LED]  (part B of 2)
SW101  FN  [SWITCH_U1_W_LED]  (part B of 2)
SW102  LEFT  [SWITCH_U1_W_LED]  (part B of 2)
SW103  DOWN  [SWITCH_U1_W_LED]  (part B of 2)
SW104  RIGHT  [SWITCH_U1_W_LED]  (part B of 2)
SW105  0NUM  [SWITCH_U2_W_LED]  (part B of 2)
SW106  .NUM  [SWITCH_U1_W_LED]  (part B of 2)

### Ports
LEDCS1, LEDCS2, LEDCS3, LEDCS4, LEDCS5, LEDCS6, LEDCS7, LEDCS8, LEDCS9, LEDCS10, LEDCS11, LEDCS12, LEDCS13, LEDCS14, LEDCS15, LEDCS16, LEDCS17, LEDCS18, LEDCS19, LEDCS20, LEDCS21, LEDCS22, LEDCS23, LEDCS24, LEDCS25, LEDCS26, LEDCS27, LEDCS28, LEDCS29, LEDCS30, LEDCS31, LEDCS32, LEDCS33, LEDCS34, LEDCS35, LEDCS36, LEDCS37, LEDCS38, LEDCS39, LEDSW1, LEDSW2, LEDSW3, LEDSW4, LEDSW5, LEDSW6, LEDSW7, LEDSW8, LEDSW9

### Nets
NetLED1_A: LED1.A LED2.A LED3.A LED4.A SW94.A SW95.A SW96.A SW97.A SW98.A SW99.A SW100.A SW101.A SW102.A ; port LEDSW2
NetLED1_B: LED1.B SW4.B SW21.B SW41.B SW55.B SW61.B SW79.B SW91.B ; port LEDCS9
NetLED1_G: LED1.G SW4.G SW21.G SW41.G SW55.G SW61.G SW79.G SW91.G ; port LEDCS8
NetLED1_R: LED1.R SW4.R SW21.R SW41.R SW55.R SW61.R SW79.R SW91.R ; port LEDCS7
NetLED2_B: LED2.B SW5.B SW22.B SW42.B SW56.B SW62.B SW80.B SW92.B ; port LEDCS6
NetLED2_G: LED2.G SW5.G SW22.G SW42.G SW56.G SW62.G SW80.G SW92.G ; port LEDCS5
NetLED2_R: LED2.R SW5.R SW22.R SW42.R SW56.R SW62.R SW80.R SW92.R ; port LEDCS4
NetLED3_B: LED3.B SW7.B SW24.B SW33.B SW44.B SW64.B SW72.B SW82.B SW104.B ; port LEDCS21
NetLED3_G: LED3.G SW7.G SW24.G SW33.G SW44.G SW64.G SW72.G SW82.G SW104.G ; port LEDCS20
NetLED3_R: LED3.R SW7.R SW24.R SW33.R SW44.R SW64.R SW72.R SW82.R SW104.R ; port LEDCS19
NetLED4_B: LED4.B SW8.B SW25.B SW34.B SW45.B SW65.B SW73.B SW83.B ; port LEDCS24
NetLED4_G: LED4.G SW8.G SW25.G SW34.G SW45.G SW65.G SW73.G SW83.G ; port LEDCS23
NetLED4_R: LED4.R SW8.R SW25.R SW34.R SW45.R SW65.R SW73.R SW83.R ; port LEDCS22
NetR2_2: SW11.B SW28.B SW37.B SW48.B SW57.B SW68.B SW86.B SW93.B SW100.B ; port LEDCS33
NetR3_2: SW11.G SW28.G SW37.G SW48.G SW57.G SW68.G SW86.G SW93.G SW100.G ; port LEDCS32
NetR4_2: SW11.R SW28.R SW37.R SW48.R SW57.R SW68.R SW86.R SW93.R SW100.R ; port LEDCS31
NetR5_2: SW10.B SW27.B SW36.B SW47.B SW67.B SW75.B SW85.B SW99.B SW106.B ; port LEDCS30
NetR6_2: SW10.G SW27.G SW36.G SW47.G SW67.G SW75.G SW85.G SW99.G SW106.G ; port LEDCS29
NetR7_2: SW10.R SW27.R SW36.R SW47.R SW67.R SW75.R SW85.R SW99.R SW106.R ; port LEDCS28
NetR8_2: SW9.B SW26.B SW35.B SW46.B SW66.B SW74.B SW84.B SW98.B SW105.B ; port LEDCS27
NetR9_2: SW9.G SW26.G SW35.G SW46.G SW66.G SW74.G SW84.G SW98.G SW105.G ; port LEDCS26
NetR10_2: SW9.R SW26.R SW35.R SW46.R SW66.R SW74.R SW84.R SW98.R SW105.R ; port LEDCS25
NetR16_2: SW12.R SW15.R SW29.R SW31.R SW49.R SW69.R SW87.R SW101.R ; port LEDCS34
NetR18_2: SW12.G SW15.G SW29.G SW31.G SW49.G SW69.G SW87.G SW101.G ; port LEDCS35
NetR19_1: SW1.B SW16.B SW18.B SW38.B SW52.B SW58.B SW76.B SW88.B SW94.B ; port LEDCS18
NetR20_2: SW12.B SW15.B SW29.B SW31.B SW49.B SW69.B SW87.B SW101.B ; port LEDCS36
NetR21_1: SW1.G SW16.G SW18.G SW38.G SW52.G SW58.G SW76.G SW88.G SW94.G ; port LEDCS17
NetR22_2: SW13.R SW14.R SW30.R SW50.R SW51.R SW70.R SW102.R ; port LEDCS37
NetR23_1: SW1.R SW16.R SW18.R SW38.R SW52.R SW58.R SW76.R SW88.R SW94.R ; port LEDCS16
NetR25_2: SW13.G SW14.G SW30.G SW50.G SW51.G SW70.G SW102.G ; port LEDCS38
NetR26_1: SW2.B SW17.B SW19.B SW39.B SW53.B SW59.B SW77.B SW89.B SW95.B ; port LEDCS15
NetR27_2: SW13.B SW14.B SW30.B SW50.B SW51.B SW70.B SW102.B ; port LEDCS39
NetR28_1: SW2.G SW17.G SW19.G SW39.G SW53.G SW59.G SW77.G SW89.G SW95.G ; port LEDCS14
NetR29_1: SW2.R SW17.R SW19.R SW39.R SW53.R SW59.R SW77.R SW89.R SW95.R ; port LEDCS13
NetR30_1: SW3.B SW20.B SW40.B SW54.B SW60.B SW78.B SW90.B SW96.B ; port LEDCS12
NetR31_1: SW3.G SW20.G SW40.G SW54.G SW60.G SW78.G SW90.G SW96.G ; port LEDCS11
NetR32_1: SW3.R SW20.R SW40.R SW54.R SW60.R SW78.R SW90.R SW96.R ; port LEDCS10
NetR40_2: SW6.R SW23.R SW32.R SW43.R SW63.R SW71.R SW81.R SW97.R SW103.R ; port LEDCS1
NetR41_2: SW6.G SW23.G SW32.G SW43.G SW63.G SW71.G SW81.G SW97.G SW103.G ; port LEDCS2
NetR42_2: SW6.B SW23.B SW32.B SW43.B SW63.B SW71.B SW81.B SW97.B SW103.B ; port LEDCS3
NetSW1_A: SW1.A SW2.A SW3.A SW4.A SW5.A SW6.A SW7.A SW8.A SW9.A SW10.A SW11.A SW12.A SW13.A ; port LEDSW1
NetSW14_A: SW14.A SW15.A SW16.A SW17.A SW32.A SW33.A SW34.A SW35.A SW36.A SW37.A ; port LEDSW7
NetSW18_A: SW18.A SW19.A SW20.A SW21.A SW22.A SW23.A SW24.A SW25.A SW26.A SW27.A SW28.A SW29.A SW30.A ; port LEDSW6
NetSW31_A: SW31.A SW52.A SW53.A SW54.A SW55.A SW56.A SW57.A SW71.A SW72.A SW73.A SW74.A SW75.A ; port LEDSW8
NetSW38_A: SW38.A SW39.A SW40.A SW41.A SW42.A SW43.A SW44.A SW45.A SW46.A SW47.A SW48.A SW49.A SW50.A ; port LEDSW5
NetSW51_A: SW51.A SW58.A SW59.A SW60.A SW61.A SW62.A SW63.A SW64.A SW65.A SW66.A SW67.A SW68.A SW69.A ; port LEDSW4
NetSW70_A: SW70.A SW76.A SW77.A SW78.A SW79.A SW80.A SW81.A SW82.A SW83.A SW84.A SW85.A SW86.A SW87.A ; port LEDSW3
NetSW88_A: SW88.A SW89.A SW90.A SW91.A SW92.A SW93.A SW103.A SW104.A SW105.A SW106.A ; port LEDSW9

### Notes on the sheet
- Text
- Title
- Size:
- Date:
- File:
- C
- Number:
- Time:
- Revision:
- Sheet
- of

### Library data of the parts
SW1-SW106 = MX_SWITCH_SINGLE_W_SMD_LED: Supplier 1: Mouser; Supplier Part Number 1: 630-ASMB-MTB0-0A3A2
LED1-LED4 = ASMB-MTB0-0A3A2: Supplier 1: Mouser; Supplier Part Number 1: 630-ASMB-MTB0-0A3A2

## Sheet MCU.SchDoc
size B
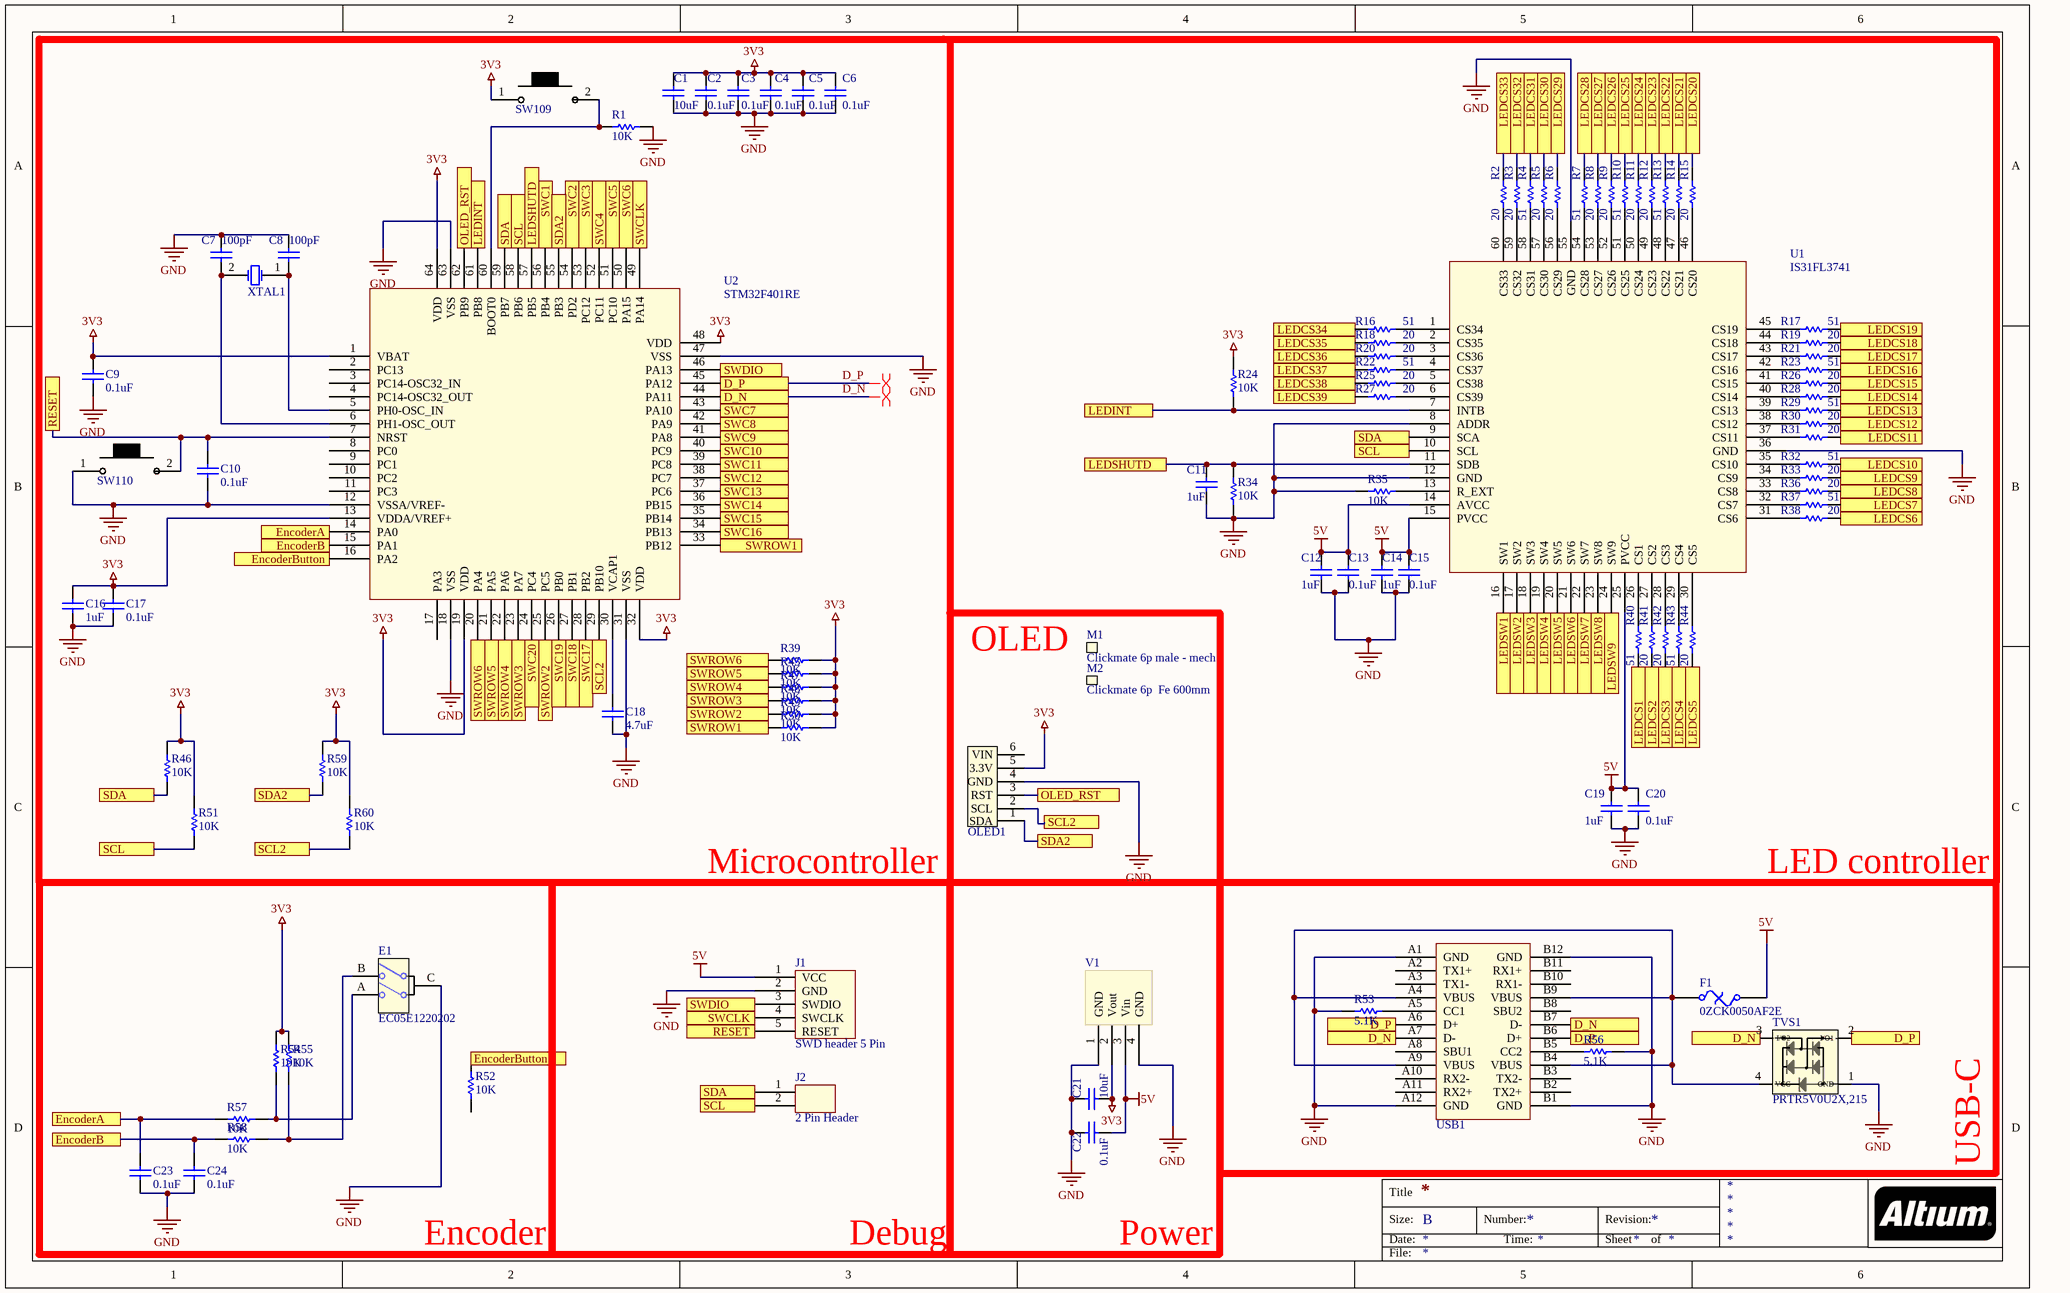
[diagram p4: MCU.SchDoc]

### Parts
C1  value 10uF  [0402_L_C]  (hidden comment: 10uF 6.3V X5R Ceramic)
C2  value 0.1uF  [0402_L_C]  (hidden comment: 0u1F 16V X7R)
C3  value 0.1uF  [0402_L_C]  (hidden comment: 0u1F 16V X7R)
C4  value 0.1uF  [0402_L_C]  (hidden comment: 0u1F 16V X7R)
C5  value 0.1uF  [0402_L_C]  (hidden comment: 0u1F 16V X7R)
C6  value 0.1uF  [0402_L_C]  (hidden comment: 0u1F 16V X7R)
C7  value 100pF  [0402_L_C]  (hidden comment: 30pF 50V np0)
C8  value 100pF  [0402_L_C]  (hidden comment: 30pF 50V np0)
C9  value 0.1uF  [0402_L_C]  (hidden comment: 0u1F 16V X7R)
C10  value 0.1uF  [0402_L_C]  (hidden comment: 0u1F 16V X7R)
C11  value 1uF  [0402_L_C]  (hidden comment: 1uF 25V X5R)
C12  value 1uF  [0402_L_C]  (hidden comment: 1uF 25V X5R)
C13  value 0.1uF  [0402_L_C]  (hidden comment: 0u1F 16V X7R)
C14  value 1uF  [0402_L_C]  (hidden comment: 1uF 25V X5R)
C15  value 0.1uF  [0402_L_C]  (hidden comment: 0u1F 16V X7R)
C16  value 1uF  [0402_L_C]  (hidden comment: 1uF 25V X5R)
C17  value 0.1uF  [0402_L_C]  (hidden comment: 0u1F 16V X7R)
C18  value 4.7uF  [0402_L_C]  (hidden comment: 4.7uF 10V X5R Ceramic)
C19  value 1uF  [0402_L_C]  (hidden comment: 1uF 25V X5R)
C20  value 0.1uF  [0402_L_C]  (hidden comment: 0u1F 16V X7R)
C21  value 10uF  [0402_L_C]  (hidden comment: 10uF 6.3V X5R Ceramic)
C22  value 0.1uF  [0402_L_C]  (hidden comment: 0u1F 16V X7R)
C23  value 0.1uF  [0402_L_C]  (hidden comment: 0u1F 16V X7R)
C24  value 0.1uF  [0402_L_C]  (hidden comment: 0u1F 16V X7R)
E1  EC05E1220202  [EC05E1220202]
F1  0ZCK0050AF2E  [0ZCK0050AF2E]
J1  SWD header 5 Pin  [SWD 5 Pin]
J2  2 Pin Header  [2 Pin Header]
M1  Clickmate 6p male - mech  (mechanical)
M2  Clickmate 6p  Fe 600mm  (mechanical)
OLED1  OLED MONO 128x32  [5025850670]  (value not drawn)
R1  10K  [0402_L]
R2  20  [0402_L]
R3  20  [0402_L]
R4  51  [0402_L]
R5  20  [0402_L]
R6  20  [0402_L]
R7  51  [0402_L]
R8  20  [0402_L]
R9  20  [0402_L]
R10  51  [0402_L]
R11  20  [0402_L]
R12  20  [0402_L]
R13  51  [0402_L]
R14  20  [0402_L]
R15  20  [0402_L]
R16  51  [0402_L]
R17  51  [0402_L]
R18  20  [0402_L]
R19  20  [0402_L]
R20  20  [0402_L]
R21  20  [0402_L]
R22  51  [0402_L]
R23  51  [0402_L]
R24  10K  [0402_L]
R25  20  [0402_L]
R26  20  [0402_L]
R27  20  [0402_L]
R28  20  [0402_L]
R29  51  [0402_L]
R30  20  [0402_L]
R31  20  [0402_L]
R32  51  [0402_L]
R33  20  [0402_L]
R34  10K  [0402_L]
R35  10K  [0402_L]
R36  20  [0402_L]
R37  51  [0402_L]
R38  20  [0402_L]
R39  10K  [0402_L]
R40  51  [0402_L]
R41  20  [0402_L]
R42  20  [0402_L]
R43  51  [0402_L]
R44  20  [0402_L]
R45  10K  [0402_L]
R46  10K  [0402_L]
R47  10K  [0402_L]
R48  10K  [0402_L]
R49  10K  [0402_L]
R50  10K  [0402_L]
R51  10K  [0402_L]
R52  10K  [0402_L]
R53  5.1K  [0402_L]
R54  10K  [0402_L]
R55  10K  [0402_L]
R56  5.1K  [0402_L]
R57  10K  [0402_L]
R58  10K  [0402_L]
R59  10K  [0402_L]
R60  10K  [0402_L]
SW109  B3U-1000P  [B3U-1000P]  (value not drawn)
SW110  B3U-1000P  [B3U-1000P]  (value not drawn)
TVS1  PRTR5V0U2X,215  [SOT143B-RF]
U1  IS31FL3741  [QFN-60 ISSI]
U2  STM32F401RE  [LQFP64-STM32]
USB1  USB C  [USB C]  (value not drawn)
V1  3.3Vreg  [SOT223 STM]  (value not drawn)
XTAL1  ATS08ASM-1E  [ATS25ASM-1E]  (value not drawn)

### Blocks framed on the sheet
Microcontroller: C1-C10 C16-C18 R1 R39 R45-R51 R59 R60 SW109 SW110 U2 XTAL1
Encoder: C23 C24 E1 R52 R54 R55 R57 R58
Power: C21 C22 V1

### Ports
D_N, D_P, EncoderA, EncoderB, EncoderButton, LEDCS1, LEDCS2, LEDCS3, LEDCS4, LEDCS5, LEDCS6, LEDCS7, LEDCS8, LEDCS9, LEDCS10, LEDCS11, LEDCS12, LEDCS13, LEDCS14, LEDCS15, LEDCS16, LEDCS17, LEDCS18, LEDCS19, LEDCS20, LEDCS21, LEDCS22, LEDCS23, LEDCS24, LEDCS25, LEDCS26, LEDCS27, LEDCS28, LEDCS29, LEDCS30, LEDCS31, LEDCS32, LEDCS33, LEDCS34, LEDCS35, LEDCS36, LEDCS37, LEDCS38, LEDCS39, LEDINT, LEDSHUTD, LEDSW1, LEDSW2, LEDSW3, LEDSW4, LEDSW5, LEDSW6, LEDSW7, LEDSW8, LEDSW9, OLED_RST, RESET, SCL, SCL2, SDA, SDA2, SWC1, SWC2, SWC3, SWC4, SWC5, SWC6, SWC7, SWC8, SWC9, SWC10, SWC11, SWC12, SWC13, SWC14, SWC15, SWC16, SWC17, SWC18, SWC19, SWC20, SWCLK, SWDIO, SWROW1, SWROW2, SWROW3, SWROW4, SWROW5, SWROW6

### Nets
3V3: C1.2 C2.2 C3.2 C4.2 C5.2 C6.2 C9.2 C16.2 C17.2 C21.2 OLED1.5(3.3V) R24.2 R39.1 R45.1 R46.2 R47.1 R48.1 R49.1 R50.1 R51.2 R54.2 R55.2 R59.2 R60.2 SW109.1 U2.1(VBAT) U2.13(VDDA/VREF+) U2.19(VDD) U2.32(VDD) U2.48(VDD) U2.64(VDD) V1.2(Vout)
5V: C12.2 C13.2 C14.2 C15.2 C19.2 C20.2 C22.2 F1.2 J1.1(VCC) U1.14(AVCC) U1.15(PVCC) U1.25(PVCC) V1.3(Vin)
GND: C1.1 C2.1 C3.1 C4.1 C5.1 C6.1 C7.2 C8.2 C9.1 C10.1 C11.1 C12.1 C13.1 C14.1 C15.1 C16.1 C17.1 C18.1 C19.1 C20.1 C21.1 C22.1 C23.1 C24.1 E1.C J1.2(GND) OLED1.4(GND) R1.2 R34.1 R35.2 R53.1 R56.2 SW110.1 TVS1.1(GND) U1.8(ADDR) U1.12(GND) U1.36(GND) U1.55(GND) U2.12(VSSA/VREF-) U2.18(VSS) U2.31(VSS) U2.47(VSS) U2.63(VSS) USB1.A1(GND) USB1.A12(GND) USB1.B1(GND) USB1.B12(GND) V1.1(GND) V1.4(GND)
D_N: TVS1.3(I/O2) U2.44(PA11) USB1.A7(D-) USB1.B7(D-) ; port D_N
D_P: TVS1.2(I/O1) U2.45(PA12) USB1.A6(D+) USB1.B6(D+) ; port D_P
NetC7_1: C7.1 U2.6(PH1-OSC_OUT) XTAL1.2(OSC2)
NetC8_1: C8.1 U2.5(PH0-OSC_IN) XTAL1.1(OSC1)
NetC10_2: C10.2 J1.5(RESET) SW110.2 U2.7(NRST) ; port RESET
NetC11_2: C11.2 R34.2 U1.11(SDB) U2.57(PB5) ; port LEDSHUTD
NetC18_2: C18.2 U2.30(VCAP1)
NetC23_2: C23.2 R57.2 U2.14(PA0) ; port EncoderA
NetC24_2: C24.2 R58.2 U2.15(PA1) ; port EncoderB
NetD1_1: U2.56(PB4) ; port SWC1
NetD2_1: U2.54(PD2) ; port SWC2
NetD3_1: U2.53(PC12) ; port SWC3
NetD4_1: U2.52(PC11) ; port SWC4
NetD5_1: U2.51(PC10) ; port SWC5
NetD6_1: U2.50(PA15) ; port SWC6
NetD7_1: U2.43(PA10) ; port SWC7
NetD8_1: U2.42(PA9) ; port SWC8
NetD9_1: U2.41(PA8) ; port SWC9
NetD10_1: U2.40(PC9) ; port SWC10
NetD11_1: U2.39(PC8) ; port SWC11
NetD12_1: U2.38(PC7) ; port SWC12
NetD13_1: U2.37(PC6) ; port SWC13
NetD14_1: U2.36(PB15) ; port SWC14
NetD15_1: U2.35(PB14) ; port SWC15
NetD16_1: U2.34(PB13) ; port SWC16
NetD17_1: U2.28(PB2) ; port SWC17
NetD35_1: U2.27(PB1) ; port SWC18
NetD36_1: U2.26(PB0) ; port SWC19
NetD37_1: U2.24(PC4) ; port SWC20
NetE1_A: E1.A R54.1 R57.1
NetE1_B: E1.B R55.1 R58.1
NetF1_1: F1.1 TVS1.4(VCC) USB1.A4(VBUS) USB1.A9(VBUS) USB1.B4(VBUS) USB1.B9(VBUS)
NetJ1_3: J1.3(SWDIO) U2.46(PA13) ; port SWDIO
NetJ1_4: J1.4(SWCLK) U2.49(PA14) ; port SWCLK
NetJ2_1: J2.1 R46.1 U1.9(SCA) U2.59(PB7) ; port SDA
NetJ2_2: J2.2 R51.1 U1.10(SCL) U2.58(PB6) ; port SCL
NetLED1_A: U1.17(SW2) ; port LEDSW2
NetLED1_B: R33.1 ; port LEDCS9
NetLED1_G: R36.1 ; port LEDCS8
NetLED1_R: R37.1 ; port LEDCS7
NetLED2_B: R38.1 ; port LEDCS6
NetLED2_G: R44.2 ; port LEDCS5
NetLED2_R: R43.2 ; port LEDCS4
NetLED3_B: R14.2 ; port LEDCS21
NetLED3_G: R15.2 ; port LEDCS20
NetLED3_R: R17.1 ; port LEDCS19
NetLED4_B: R11.2 ; port LEDCS24
NetLED4_G: R12.2 ; port LEDCS23
NetLED4_R: R13.2 ; port LEDCS22
NetOLED1_1: OLED1.1(SDA) R59.1 U2.55(PB3) ; port SDA2
NetOLED1_2: OLED1.2(SCL) R60.1 U2.29(PB10) ; port SCL2
NetOLED1_3: OLED1.3(RST) U2.62(PB9) ; port OLED_RST
NetR1_1: R1.1 SW109.2 U2.60(BOOT0)
NetR2_1: R2.1 U1.60(CS33)
NetR2_2: R2.2 ; port LEDCS33
NetR3_1: R3.1 U1.59(CS32)
NetR3_2: R3.2 ; port LEDCS32
NetR4_1: R4.1 U1.58(CS31)
NetR4_2: R4.2 ; port LEDCS31
NetR5_1: R5.1 U1.57(CS30)
NetR5_2: R5.2 ; port LEDCS30
NetR6_1: R6.1 U1.56(CS29)
NetR6_2: R6.2 ; port LEDCS29
NetR7_1: R7.1 U1.54(CS28)
NetR7_2: R7.2 ; port LEDCS28
NetR8_1: R8.1 U1.53(CS27)
NetR8_2: R8.2 ; port LEDCS27
NetR9_1: R9.1 U1.52(CS26)
NetR9_2: R9.2 ; port LEDCS26
NetR10_1: R10.1 U1.51(CS25)
NetR10_2: R10.2 ; port LEDCS25
NetR11_1: R11.1 U1.50(CS24)
NetR12_1: R12.1 U1.49(CS23)
NetR13_1: R13.1 U1.48(CS22)
NetR14_1: R14.1 U1.47(CS21)
NetR15_1: R15.1 U1.46(CS20)
NetR16_1: R16.1 U1.1(CS34)
NetR16_2: R16.2 ; port LEDCS34
NetR17_2: R17.2 U1.45(CS19)
NetR18_1: R18.1 U1.2(CS35)
NetR18_2: R18.2 ; port LEDCS35
NetR19_1: R19.1 ; port LEDCS18
NetR19_2: R19.2 U1.44(CS18)
NetR20_1: R20.1 U1.3(CS36)
NetR20_2: R20.2 ; port LEDCS36
NetR21_1: R21.1 ; port LEDCS17
NetR21_2: R21.2 U1.43(CS17)
NetR22_1: R22.1 U1.4(CS37)
NetR22_2: R22.2 ; port LEDCS37
NetR23_1: R23.1 ; port LEDCS16
NetR23_2: R23.2 U1.42(CS16)
NetR24_1: R24.1 U1.7(INTB) U2.61(PB8) ; port LEDINT
NetR25_1: R25.1 U1.5(CS38)
NetR25_2: R25.2 ; port LEDCS38
NetR26_1: R26.1 ; port LEDCS15
NetR26_2: R26.2 U1.41(CS15)
NetR27_1: R27.1 U1.6(CS39)
NetR27_2: R27.2 ; port LEDCS39
NetR28_1: R28.1 ; port LEDCS14
NetR28_2: R28.2 U1.40(CS14)
NetR29_1: R29.1 ; port LEDCS13
NetR29_2: R29.2 U1.39(CS13)
NetR30_1: R30.1 ; port LEDCS12
NetR30_2: R30.2 U1.38(CS12)
NetR31_1: R31.1 ; port LEDCS11
NetR31_2: R31.2 U1.37(CS11)
NetR32_1: R32.1 ; port LEDCS10
NetR32_2: R32.2 U1.35(CS10)
NetR33_2: R33.2 U1.34(CS9)
NetR35_1: R35.1 U1.13(R_EXT)
NetR36_2: R36.2 U1.33(CS8)
NetR37_2: R37.2 U1.32(CS7)
NetR38_2: R38.2 U1.31(CS6)
NetR39_2: R39.2 U2.20(PA4) ; port SWROW6
NetR40_1: R40.1 U1.26(CS1)
NetR40_2: R40.2 ; port LEDCS1
NetR41_1: R41.1 U1.27(CS2)
NetR41_2: R41.2 ; port LEDCS2
NetR42_1: R42.1 U1.28(CS3)
NetR42_2: R42.2 ; port LEDCS3
NetR43_1: R43.1 U1.29(CS4)
NetR44_1: R44.1 U1.30(CS5)
NetR45_2: R45.2 U2.21(PA5) ; port SWROW5
NetR47_2: R47.2 U2.22(PA6) ; port SWROW4
NetR48_2: R48.2 U2.23(PA7) ; port SWROW3
NetR49_2: R49.2 U2.25(PC5) ; port SWROW2
NetR50_2: R50.2 U2.33(PB12) ; port SWROW1
NetR52_2: R52.2 U2.16(PA2) ; port EncoderButton
NetR53_2: R53.2 USB1.A5(CC1)
NetR56_1: R56.1 USB1.B5(CC2)
NetSW1_A: U1.16(SW1) ; port LEDSW1
NetSW14_A: U1.22(SW7) ; port LEDSW7
NetSW18_A: U1.21(SW6) ; port LEDSW6
NetSW31_A: U1.23(SW8) ; port LEDSW8
NetSW38_A: U1.20(SW5) ; port LEDSW5
NetSW51_A: U1.19(SW4) ; port LEDSW4
NetSW70_A: U1.18(SW3) ; port LEDSW3
NetSW88_A: U1.24(SW9) ; port LEDSW9

Not connected (* = marked no-connect by the designer): OLED1 6(VIN); R52 1; U2 2(PC13) 3(PC14-OSC32_IN) 4(PC14-OSC32_OUT) 8(PC0) 9(PC1) 10(PC2) 11(PC3) 17(PA3); USB1 A2(TX1+) A3(TX1-) A8(SBU1) A10(RX2-) A11(RX2+) B2(TX2+) B3(TX2-) B8(SBU2) B10(RX1-) B11(RX1+)

### Layout directives
differential pair: D_N, D_P

### Notes on the sheet
- OLED
- LED controller
- USB-C
- Debug
- Title
- Size:
- Date:
- B
- Number:
- Time:
- Revision:
- Sheet
- of
- File:

### Library data of the parts
C1 C21 = 10uF 6.3V X5R Ceramic: Capacitor; Published: 8-Jun-2000; LatestRevisionDate: 17-Jul-2002; LatestRevisionNote: Re-released for DXP Platform.; PackageReference: RAD-0.3; Publisher: Altium Limited; PackageDescription: Radial Cap, Thru-Hole; 2 Leads; 0.3 in Pin Spacing; Supplier 1: Mouser; Supplier Part Number 1: 81-GRJ155R60J106ME1D
C2-C6 C9 C10 C13 C15 C17 C20 C22-C24 = 0u1F 16V X7R: Capacitor; Published: 8-Jun-2000; LatestRevisionDate: 17-Jul-2002; LatestRevisionNote: Re-released for DXP Platform.; PackageReference: RAD-0.3; Publisher: Altium Limited; PackageDescription: Radial Cap, Thru-Hole; 2 Leads; 0.3 in Pin Spacing; Supplier 1: Mouser; Supplier Part Number 1: 81-GRM155R71C104KA88
C7 C8 = 30pF 50V np0: Capacitor; Published: 8-Jun-2000; LatestRevisionDate: 17-Jul-2002; LatestRevisionNote: Re-released for DXP Platform.; PackageReference: RAD-0.3; Publisher: Altium Limited; PackageDescription: Radial Cap, Thru-Hole; 2 Leads; 0.3 in Pin Spacing; Supplier 1: Mouser; Supplier Part Number 1: 603-CC402JRNPO9BN300
C11 C12 C14 C16 C19 = 1uF 25V X5R: Capacitor; Published: 8-Jun-2000; LatestRevisionDate: 17-Jul-2002; LatestRevisionNote: Re-released for DXP Platform.; PackageReference: RAD-0.3; Publisher: Altium Limited; PackageDescription: Radial Cap, Thru-Hole; 2 Leads; 0.3 in Pin Spacing; Supplier 1: Mouser; Supplier Part Number 1: 810-C1005X5R1E105M
C18 = 4.7uF 10V X5R Ceramic: Capacitor; Published: 8-Jun-2000; LatestRevisionDate: 17-Jul-2002; LatestRevisionNote: Re-released for DXP Platform.; PackageReference: RAD-0.3; Publisher: Altium Limited; PackageDescription: Radial Cap, Thru-Hole; 2 Leads; 0.3 in Pin Spacing; Supplier 1: Mouser; Supplier Part Number 1: 81-ZRB15XR61A475KE1D
F1 = 0ZCK0050AF2E: Thermal Fuse; Published: 24-Mar-1999; LatestRevisionDate: 17-Jul-2002; LatestRevisionNote: Re-released for DXP Platform.; PackageReference: PIN-W2/E2.8; Publisher: Altium Limited; PackageDescription: Thru-Hole; 2 Leads; Supplier 1: Mouser; Supplier Part Number 1: 530-0ZCK0050AF2E
M2 = ClickMate 6p female 600mm - mech: Supplier 1: Digi-Key; Supplier Part Number 1: WM16513-ND
R1 R24 R34 R35 R39 R45-R52 R54 R55 R57-R60 = 10K: Resistor; Published: 8-Jun-2000; LatestRevisionDate: 17-Jul-2002; LatestRevisionNote: Re-released for DXP Platform.; PackageReference: AXIAL-0.3; Publisher: Altium Limited; PackageDescription: Axial Device, Thru-Hole; 2 Leads; 0.3 in Pin Spacing; Supplier 1: Mouser; Supplier Part Number 1: 603-RC0402FR-0710KL; Value: 10K
R2 R3 R5 R6 R8 R9 R11 R12 R14 R15 R18-R21 R25-R28 R30 R31 R33 R36 R38 R41 R42 R44 = 20: Resistor; Published: 8-Jun-2000; LatestRevisionDate: 17-Jul-2002; LatestRevisionNote: Re-released for DXP Platform.; PackageReference: AXIAL-0.3; Publisher: Altium Limited; PackageDescription: Axial Device, Thru-Hole; 2 Leads; 0.3 in Pin Spacing; Supplier 1: Mouser; Supplier Part Number 1: 603-RC0402FR-0720RL; Value: 20
R4 R7 R10 R13 R16 R17 R22 R23 R29 R32 R37 R40 R43 = 51: Resistor; Published: 8-Jun-2000; LatestRevisionDate: 17-Jul-2002; LatestRevisionNote: Re-released for DXP Platform.; PackageReference: AXIAL-0.3; Publisher: Altium Limited; PackageDescription: Axial Device, Thru-Hole; 2 Leads; 0.3 in Pin Spacing; Supplier 1: Mouser; Supplier Part Number 1: 603-RC0402FR-0751RL; Value: 51
R53 R56 = 5.1K: Resistor; Published: 8-Jun-2000; LatestRevisionDate: 17-Jul-2002; LatestRevisionNote: Re-released for DXP Platform.; PackageReference: AXIAL-0.3; Publisher: Altium Limited; PackageDescription: Axial Device, Thru-Hole; 2 Leads; 0.3 in Pin Spacing; Value: 5.1K; Supplier 1: Mouser; Supplier Part Number 1: 71-CRCW0402J-5.1K-E3
V1 = LD1117S33CTR: Supplier 1: Digi-Key; Supplier Part Number 1: 497-1241-6-ND
XTAL1 = ATS08ASM-1E: 8MHz 60ESR 20pF; Supplier 1: Mouser; Supplier Part Number 1: 774-ATS08ASM-1E
E1 = EC05E1220202: Supplier 1: Mouser; Supplier Part Number 1: 688-EC05E1220202
M1 = Clickmate 6p male - mech: Supplier 1: Mouser; Supplier Part Number 1: 538-502585-0670
OLED1 = OLED MONO 128x32: Supplier 1: Mouser; Supplier Part Number 1: 485-931
SW109 SW110 = B3U-1000P: Supplier 1: Mouser; Supplier Part Number 1: 653-B3U-1000P
TVS1 = PRTR5V0U2X,215: Supplier 1: Mouser; Supplier Part Number 1: 771-PRTR5V0U2X-T/R
U1 = IS31FL3741: Supplier 1: Mouser; Supplier Part Number 1: 870-IS31FL3741QFLS4T
U2 = STM32F401RE: Supplier 1: Mouser; Supplier Part Number 1: 511-STM32F401RET6
USB1 = USB C: Supplier 1: Mouser; Supplier Part Number 1: 538-105455-0101

## Nets that join several sheets
NetD1_1: switches (6 pins), MCU (U2.56)
NetD2_1: switches (6 pins), MCU (U2.54)
NetD3_1: switches (6 pins), MCU (U2.53)
NetD4_1: switches (5 pins), MCU (U2.52)
NetD5_1: switches (5 pins), MCU (U2.51)
NetD6_1: switches (6 pins), MCU (U2.50)
NetD7_1: switches (5 pins), MCU (U2.43)
NetD8_1: switches (5 pins), MCU (U2.42)
NetD9_1: switches (6 pins), MCU (U2.41)
NetD10_1: switches (6 pins), MCU (U2.40)
NetD11_1: switches (6 pins), MCU (U2.39)
NetD12_1: switches (5 pins), MCU (U2.38)
NetD13_1: switches (D13.1 D30.1 D50.1), MCU (U2.37)
NetD14_1: switches (6 pins), MCU (U2.36)
NetD15_1: switches (6 pins), MCU (U2.35)
NetD16_1: switches (6 pins), MCU (U2.34)
NetD17_1: switches (6 pins), MCU (U2.28)
NetD35_1: switches (D35.1 D55.1 D74.1 D91.1), MCU (U2.27)
NetD36_1: switches (5 pins), MCU (U2.26)
NetD37_1: switches (D37.1 D57.1 D93.1), MCU (U2.24)
NetLED1_A: LED (13 pins), MCU (U1.17)
NetLED1_B: LED (8 pins), MCU (R33.1)
NetLED1_G: LED (8 pins), MCU (R36.1)
NetLED1_R: LED (8 pins), MCU (R37.1)
NetLED2_B: LED (8 pins), MCU (R38.1)
NetLED2_G: LED (8 pins), MCU (R44.2)
NetLED2_R: LED (8 pins), MCU (R43.2)
NetLED3_B: LED (9 pins), MCU (R14.2)
NetLED3_G: LED (9 pins), MCU (R15.2)
NetLED3_R: LED (9 pins), MCU (R17.1)
NetLED4_B: LED (8 pins), MCU (R11.2)
NetLED4_G: LED (8 pins), MCU (R12.2)
NetLED4_R: LED (8 pins), MCU (R13.2)
NetR2_2: LED (9 pins), MCU (R2.2)
NetR3_2: LED (9 pins), MCU (R3.2)
NetR4_2: LED (9 pins), MCU (R4.2)
NetR5_2: LED (9 pins), MCU (R5.2)
NetR6_2: LED (9 pins), MCU (R6.2)
NetR7_2: LED (9 pins), MCU (R7.2)
NetR8_2: LED (9 pins), MCU (R8.2)
NetR9_2: LED (9 pins), MCU (R9.2)
NetR10_2: LED (9 pins), MCU (R10.2)
NetR16_2: LED (8 pins), MCU (R16.2)
NetR18_2: LED (8 pins), MCU (R18.2)
NetR19_1: LED (9 pins), MCU (R19.1)
NetR20_2: LED (8 pins), MCU (R20.2)
NetR21_1: LED (9 pins), MCU (R21.1)
NetR22_2: LED (7 pins), MCU (R22.2)
NetR23_1: LED (9 pins), MCU (R23.1)
NetR25_2: LED (7 pins), MCU (R25.2)
NetR26_1: LED (9 pins), MCU (R26.1)
NetR27_2: LED (7 pins), MCU (R27.2)
NetR28_1: LED (9 pins), MCU (R28.1)
NetR29_1: LED (9 pins), MCU (R29.1)
NetR30_1: LED (8 pins), MCU (R30.1)
NetR31_1: LED (8 pins), MCU (R31.1)
NetR32_1: LED (8 pins), MCU (R32.1)
NetR39_2: switches (13 pins), MCU (R39.2 U2.20)
NetR40_2: LED (9 pins), MCU (R40.2)
NetR41_2: LED (9 pins), MCU (R41.2)
NetR42_2: LED (9 pins), MCU (R42.2)
NetR45_2: switches (18 pins), MCU (R45.2 U2.21)
NetR47_2: switches (18 pins), MCU (R47.2 U2.22)
NetR48_2: switches (20 pins), MCU (R48.2 U2.23)
NetR49_2: switches (20 pins), MCU (R49.2 U2.25)
NetR50_2: switches (17 pins), MCU (R50.2 U2.33)
NetSW1_A: LED (13 pins), MCU (U1.16)
NetSW14_A: LED (10 pins), MCU (U1.22)
NetSW18_A: LED (13 pins), MCU (U1.21)
NetSW31_A: LED (12 pins), MCU (U1.23)
NetSW38_A: LED (13 pins), MCU (U1.20)
NetSW51_A: LED (13 pins), MCU (U1.19)
NetSW70_A: LED (13 pins), MCU (U1.18)
NetSW88_A: LED (10 pins), MCU (U1.24)